# EasyEDA Pro project 2024-ZT-2.eprj

# Schematic SCH

## Sheets
1 P1: Create Date: 2024-05-02; Page Name: P1; Project Name: 2024-ZT-2; Schematic Name: SCH; Update Date: 2024-05-02; Company: 嘉立创EDA; Page Size: A4; Version: V1.0
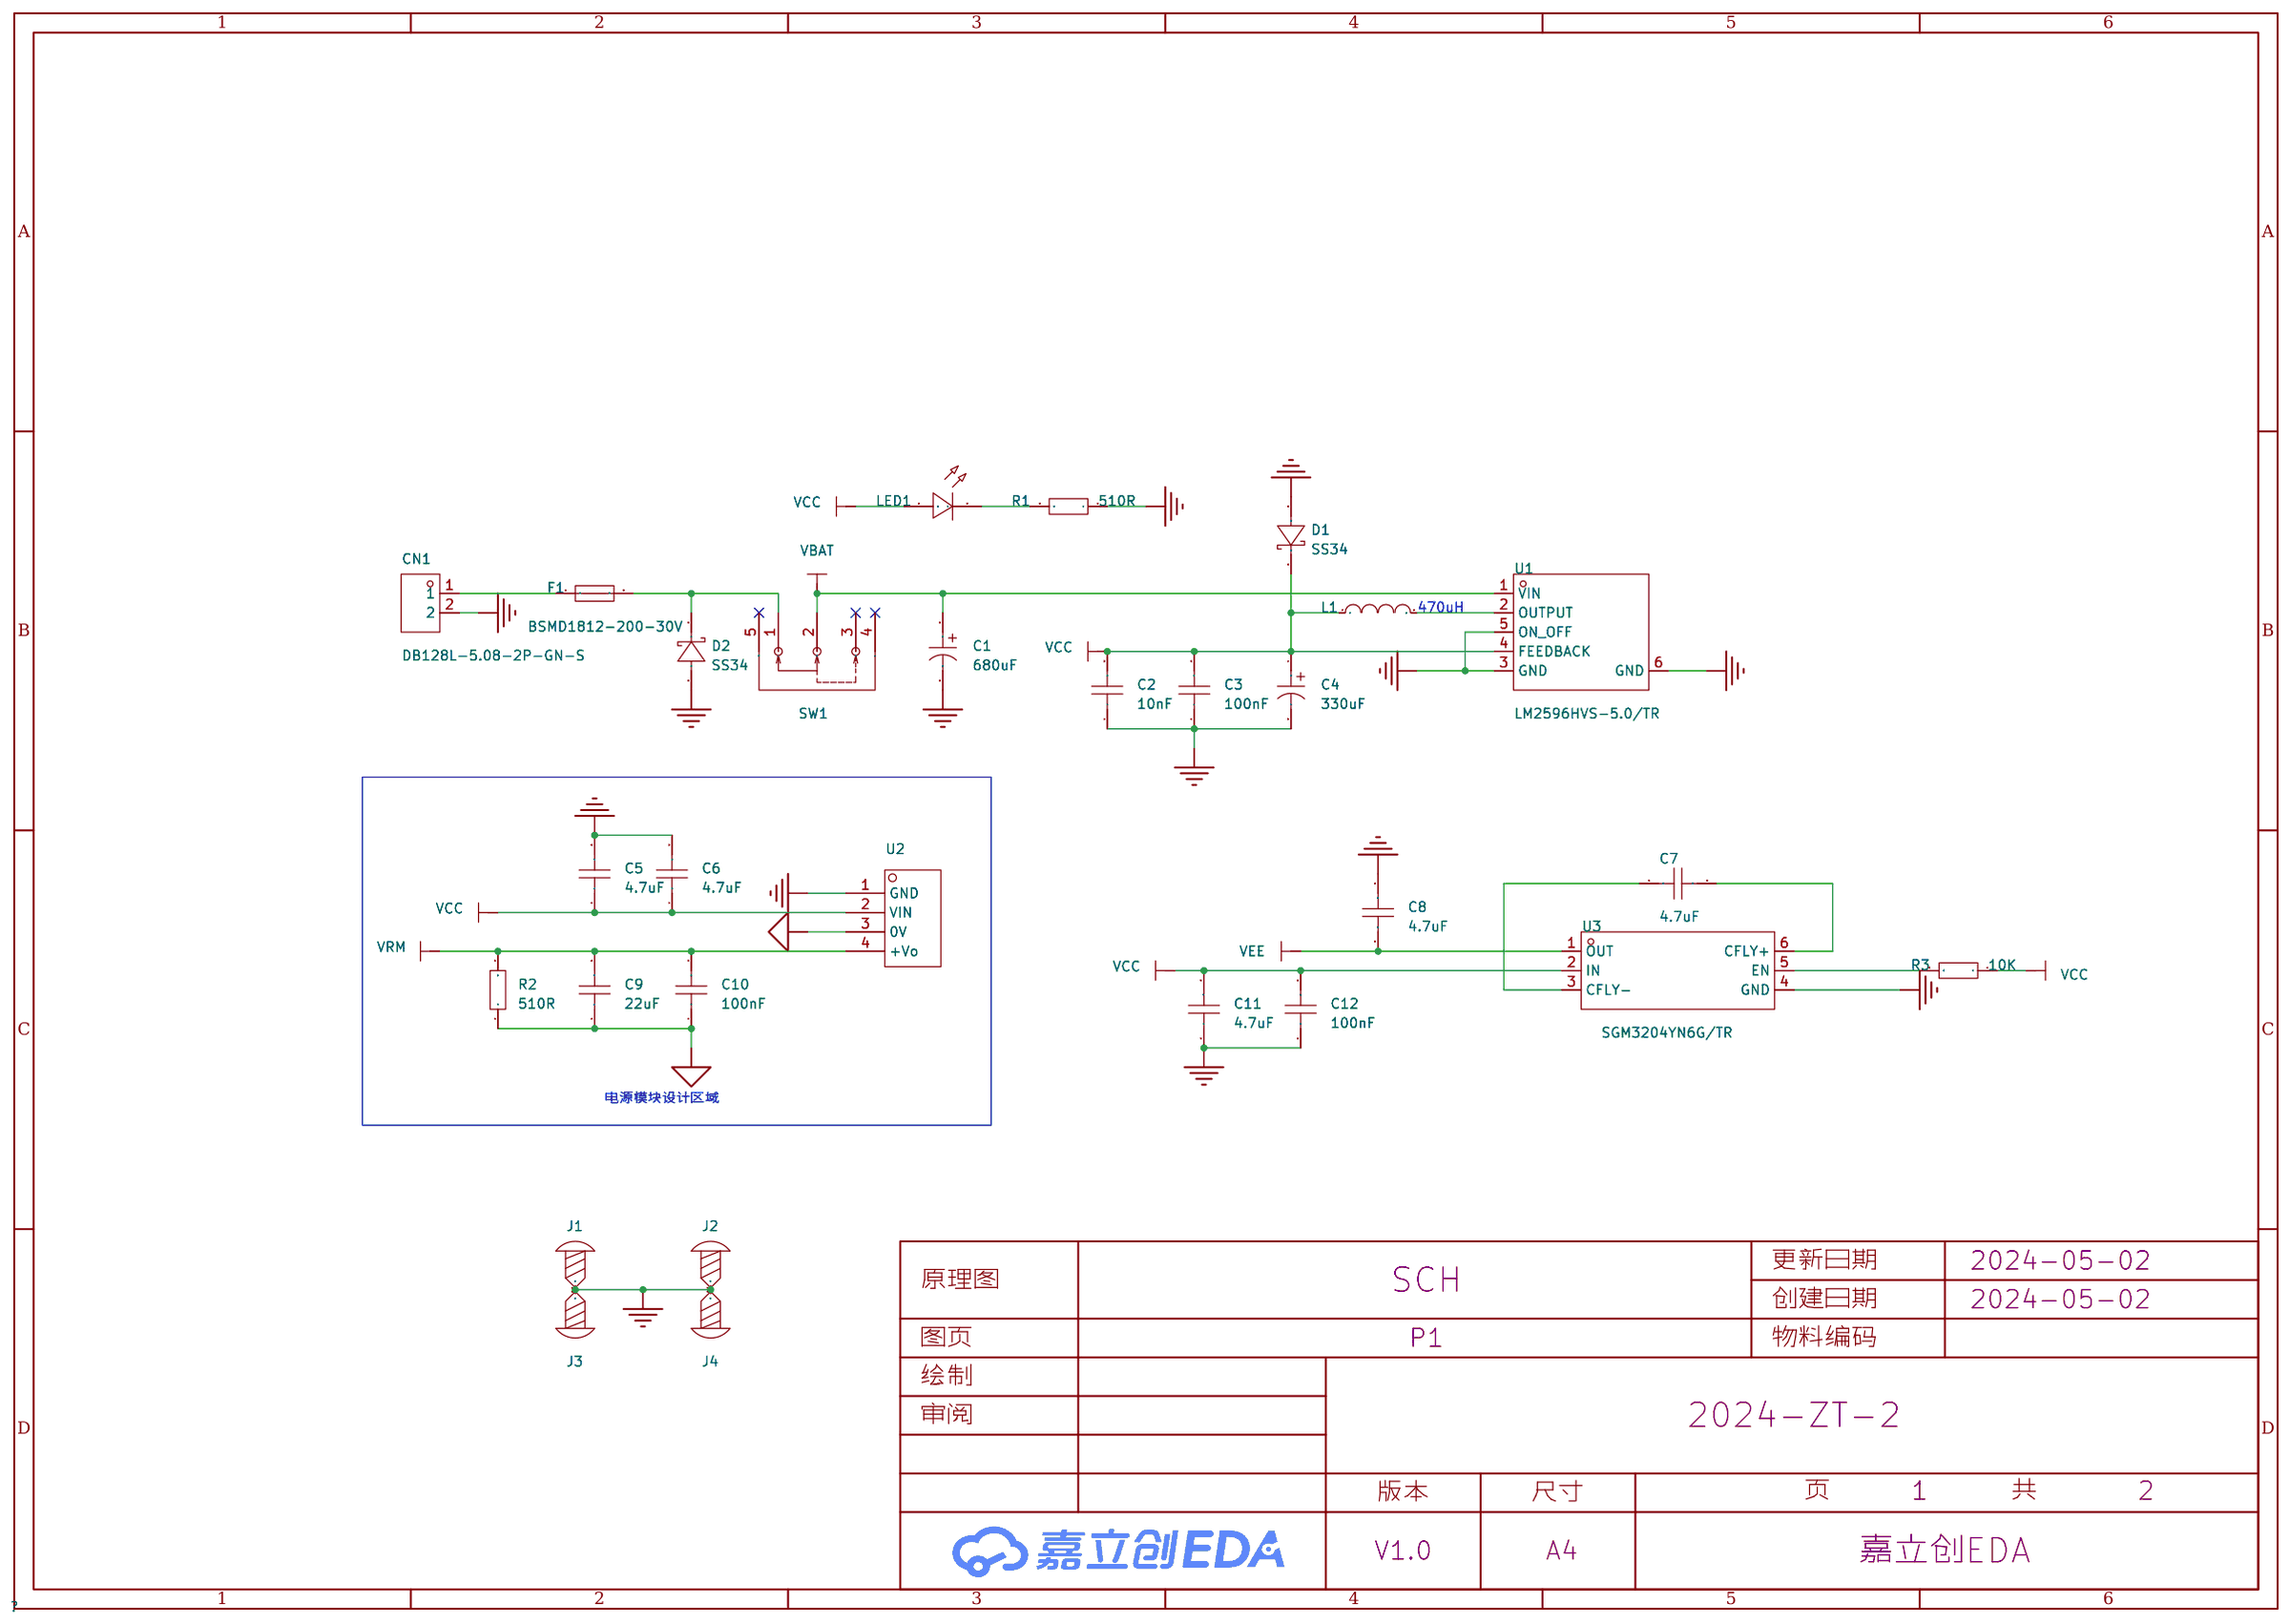
[diagram p0: P1]
2 P2: Page Name: P2; Company: EDA设计与开发
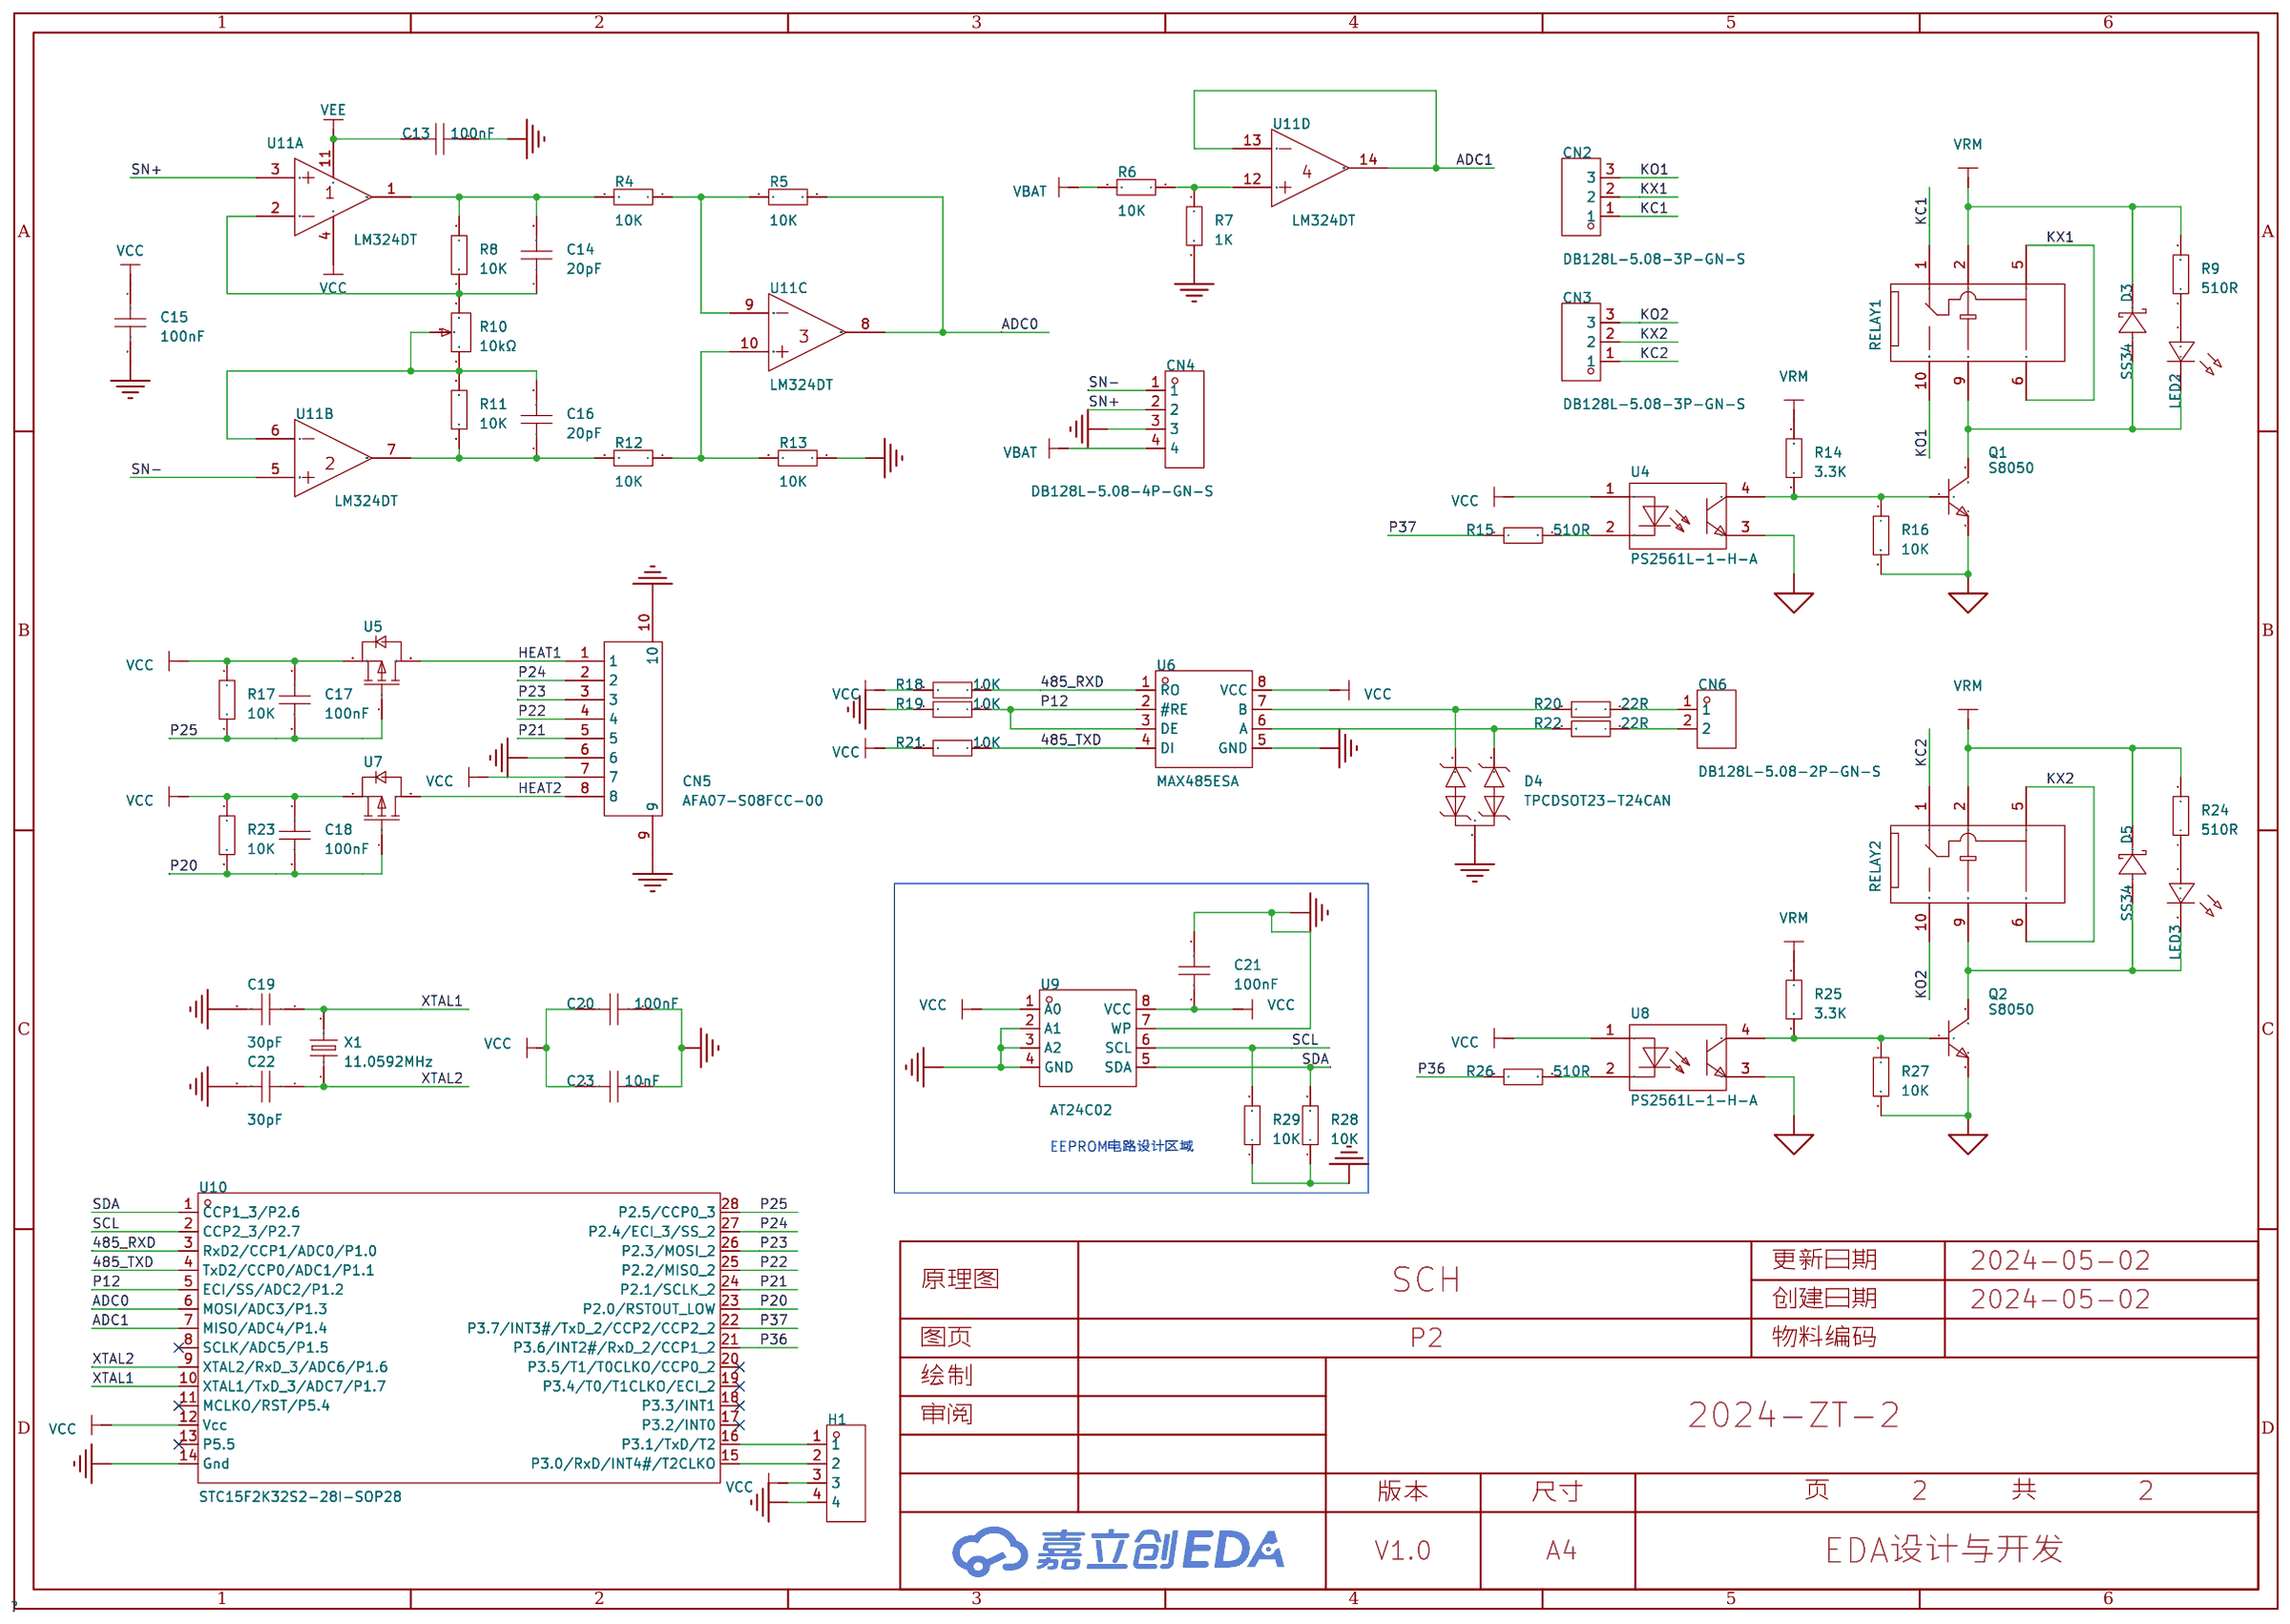
[diagram p1: P2]

## Parts
sheet P1
C1  680uF  [CAP-SMD_BD10.0-L10.3-W10.3-LS11.3-FD]
C2  10nF  [C0805]
C3  100nF  [C0805]
C4  330uF  [CAP-SMD_BD6.3-L6.6-W6.6-LS7.6-RD]
C5  4.7uF  [C1206]
C6  4.7uF  [C1206]
C7  4.7uF  [C1206]
C8  4.7uF  [C1206]
C9  22uF  [C1206]
C10  100nF  [C0805]
C11  4.7uF  [C1206]
C12  100nF  [C0805]
CN1  DB128L-5.08-2P-GN-S  [CONN-TH_2P-P5.08_DB128L-5.08-2P]
D1  SS34  [SMA_L4.3-W2.5-LS5.0-RD]
D2  SS34  [SMA_L4.3-W2.5-LS5.0-RD]
F1  BSMD1812-200-30V  [F1812]
J1  -  [M2螺丝]
J2  -  [M2螺丝]
J3  -  [M2螺丝]
J4  -  [M2螺丝]
L1  470uH  [IND-SMD_L12.0-W12.0_YPRH120X]
LED1  -  [LED_TH-3mm]
R1  510R  [R0805]
R2  510R  [R0805]
R3  10K  [R0805]
SW1  SK12D07VG4  [SW-TH_SK12D07VG4]
U1  LM2596HVS-5.0/TR  [TO-263-5_L10.2-W8.9-P1.70-LS15.2-BR]
U2  -  [TH_PCON]
U3  SGM3204YN6G/TR  [SOT-23-6_L2.9-W1.6-P0.95-LS2.8-BR]
sheet P2
C13  100nF  [C0805]
C14  20pF  [C0805]
C15  100nF  [C0805]
C16  20pF  [C0805]
C17  100nF  [C0805]
C18  100nF  [C0805]
C19  30pF  [C0805]
C20  100nF  [C0805]
C21  100nF  [C0805]
C22  30pF  [C0805]
C23  10nF  [C0805]
CN2  DB128L-5.08-3P-GN-S  [CONN-TH_DB128L-5.08-3P]
CN3  DB128L-5.08-3P-GN-S  [CONN-TH_DB128L-5.08-3P]
CN4  DB128L-5.08-4P-GN-S  [CONN-TH_4P_DB128L-5.08-4P-GN-S]
CN5  AFA07-S08FCC-00  [FPC-SMD_P1.00-8P_LCS-XJ-H2.5]
CN6  DB128L-5.08-2P-GN-S  [CONN-TH_2P-P5.08_DB128L-5.08-2P]
D3  SS34  [SMA_L4.3-W2.5-LS5.0-RD]
D4  TPCDSOT23-T24CAN  [SOT-23-3_L2.9-W1.3-P1.90-LS2.4-BR]
D5  SS34  [SMA_L4.3-W2.5-LS5.0-RD]
H1  -  [HDR-TH_4P-P2.54-V-F]
LED2  -  [LED_TH-3mm]
LED3  -  [LED_TH-3mm]
Q1  S8050  [SOT-23-3_L2.9-W1.3-P1.90-LS2.4-BR]
Q2  S8050  [SOT-23-3_L2.9-W1.3-P1.90-LS2.4-BR]
R4  10K  [R0805]
R5  10K  [R0805]
R6  10K  [R0805]
R7  1K  [R0805]
R8  10K  [R0805]
R9  510R  [R0805]
R10  10kΩ  [RES-ADJ-TH_3P-L10.0-W10.0-P2.50-BL-BS]
R11  10K  [R0805]
R12  10K  [R0805]
R13  10K  [R0805]
R14  3.3K  [R0805]
R15  510R  [R0805]
R16  10K  [R0805]
R17  10K  [R0805]
R18  10K  [R0805]
R19  10K  [R0805]
R20  22R  [R0805]
R21  10K  [R0805]
R22  22R  [R0805]
R23  10K  [R0805]
R24  510R  [R0805]
R25  3.3K  [R0805]
R26  510R  [R0805]
R27  10K  [R0805]
R28  10K  [R0805]
R29  10K  [R0805]
RELAY1  G5V-1 DC5  [RELAY-TH_G5V-1]
RELAY2  G5V-1 DC5  [RELAY-TH_G5V-1]
U4  PS2561L-1-H-A  [SOP-4_L6.5-W4.6-P2.54-LS9.6-TL]
U5  SI2301-ZE  [SOT-23-3_L2.9-W1.3-P1.90-LS2.4-BR]
U6  MAX485ESA  [SOP-8_L5.0-W4.0-P1.27-LS6.0-BL]
U7  SI2301-ZE  [SOT-23-3_L2.9-W1.3-P1.90-LS2.4-BR]
U8  PS2561L-1-H-A  [SOP-4_L6.5-W4.6-P2.54-LS9.6-TL]
U9  AT24C02  [SOP-8_L4.9-W3.9-P1.27-LS6.0-BL]
U10  STC15F2K32S2-28I-SOP28  [SOP-28_L17.9-W7.5-P1.27-LS10.3-BL]
U11  LM324DT  [SOIC-14_L8.7-W3.9-P1.27-LS6.0-BL]  (sections 1,2,3,4)
X1  11.0592MHz  [HC-49US_L11.5-W4.5-P4.88]

## Library data of the parts
C1 = 126RV0105: 容值:680uF;精度:±20%;额定电压:35V;纹波电流:380mA;; LCSC Part Name: 680uF ±20% 35V; Supplier Part: C7461236; Manufacturer: KNSCHA(科尼盛); Supplier Footprint: SMD,D10xL10.5mm; JLCPCB Part Class: Extended Part; Datasheet: https://atta.szlcsc.com/upload/public/pdf/source/20230711/6451BDCB5B323B6F7EF00B061BF0BEEC.pdf; Supplier: LCSC; Tolerance: ±20%; Rated Voltage: 35V; Ripple Current: 380mA; φD: 10mm; L: 10.5mm; Lifetime @ Temp: 2000hrs@105℃; Operating Temperature: -55℃~+105℃
C2 C3 C10 C12-C23 = CAP_0805: Supplier Footprint: 0805
C4 = 126RV0107: 容值:330uF;精度:±20%;额定电压:16V;纹波电流:170mA;; LCSC Part Name: 330uF ±20% 16V; Supplier Part: C7461238; Manufacturer: KNSCHA(科尼盛); Supplier Footprint: SMD,D6.3xL7.7mm; JLCPCB Part Class: Extended Part; Datasheet: https://atta.szlcsc.com/upload/public/pdf/source/20230711/6451BDCB5B323B6F7EF00B061BF0BEEC.pdf; Supplier: LCSC; Tolerance: ±20%; Rated Voltage: 16V; Ripple Current: 170mA; φD: 6.3mm; L: 7.7mm; Lifetime @ Temp: 2000hrs@105℃; Operating Temperature: -55℃~+105℃
C5-C9 C11 = CL31A226KOHNNNE: 容值:22uF;精度:±10%;额定电压:16V;材质(温度系数):X5R;; LCSC Part Name: 22uF ±10% 16V; Supplier Part: C90146; Manufacturer: SAMSUNG(三星); Supplier Footprint: 1206; JLCPCB Part Class: 扩展库; Datasheet: https://atta.szlcsc.com/upload/public/pdf/source/20161228/1482890861309.pdf; Supplier: LCSC; Tolerance: ±10%; Voltage Rated: 16V; Temperature Coefficient: X5R
CN1 CN6 = DB128L-5.08-2P-GN-S: 结构:1x2P;间距:5.08mm;颜色:绿色;安装方式:直插;额定电流:18A;额定电压:250V;排数:1;线规 - AWG:12~30;线规 - 平方毫米:2.5;每排PIN数:2;工作温度范围:-40℃~+105℃;; LCSC Part Name: 5.08mm 1x2P 排数:1 每排P数:2 直插; Supplier Part: C395868; Manufacturer: DORABO(地博电气); Supplier Footprint: 插件,P=5.08mm; JLCPCB Part Class: 扩展库; Datasheet: https://atta.szlcsc.com/upload/public/pdf/source/20230106/B067FE0E641A396A370D47F93C345689.pdf; Supplier: LCSC; Structure: 1x2P; Pitch: 5.08mm; Color: 绿色; Mounting Style: 直插; Current Rating (Max): 18A; Voltage Rating (Max): 250V; Number of Pins: 2P; Number of Rows: 1; Wire Gauge - AWG: 12~30; Wire Gauge - mm2: 2.5; Number of PINs Per Row: 2; Operating Temperature Range: -40℃~+105℃
D1-D3 D5 = SS34_C727060: 二极管配置:独立式;正向压降(Vf):550mV@3A;直流反向耐压(Vr):40V;平均整流电流(Io):3A;; LCSC Part Name: 电压:40V 电流:3A; Supplier Part: C727060; Manufacturer: TWGMC(台湾迪嘉); Supplier Footprint: SMA(DO-214AC); JLCPCB Part Class: 扩展库; Datasheet: https://atta.szlcsc.com/upload/public/pdf/source/20200828/C727059_6599B6CAC5F3238B9C33E46794659DBE.pdf; Supplier: LCSC; Diode Configuration: 独立式; Forward Voltage (Vf@If): 550mV@3A; Reverse Voltage (Vr): 40V; Average Rectified Current (Io): 3A; Reverse Leakage Current (Ir): 500uA@40V
F1 = BSMD1812-200-30V: 最大电压:30V;最大电流:40A;保持电流:2A;跳闸电流:4A;; LCSC Part Name: 30V 2A 1812自恢复; Supplier Part: C960026; Manufacturer: BHFUSE(佰宏); Supplier Footprint: 1812; JLCPCB Part Class: 扩展库; Datasheet: https://atta.szlcsc.com/upload/public/pdf/source/20230512/6ED7FF50F668B3AF958C55F12246A840.pdf; Supplier: LCSC; Operating Voltage (Max): 30V; Current Rating (Max): 40A; Hold Current: 2A; Trip Current: 4A; Power Dissipation: 1W; Resistance - Initial (Ri) (Min): 20mΩ; Resistance - Post Trip (R1) (Max): 100mΩ; Maximum Time to Trip: 2s; Operating Temperature: -40℃~+85℃
J1-J4 = M2螺丝: Supplier Footprint: 插件
L1 = YPRH1209-471M: 电感值:470uH;精度:±20%;额定电流:1.06A;; LCSC Part Name: 470uH ±20%; Supplier Part: C718309; Manufacturer: YJYCOIN(益嘉源); Supplier Footprint: SMD,12x12mm; JLCPCB Part Class: 扩展库; Datasheet: https://atta.szlcsc.com/upload/public/pdf/source/20200623/C339955_D39FA66995A9BB8553FDBD7D9E6E5CB5.pdf; Supplier: LCSC; Tolerance: ±20%; Rated Current: 1.06A; DC Resistance (DCR): 471mΩ
LED1 = LED_TH-R_3mm: Supplier Footprint: 插件
R1-R9 R11-R29 = Res_0805: Supplier Footprint: 0805
SW1 = SK12D07VG4: 电路结构:单刀双掷;安装方式:侧插;额定电流(DC):500mA;额定电压(DC):50V;额定电流(AC):-;额定电压(AC):-;机械寿命:5千次;; LCSC Part Name: 3脚2档位 卧插 滑动开关; Supplier Part: C393937; Manufacturer: SHOU HAN(首韩); Supplier Footprint: 插件; JLCPCB Part Class: 扩展库; Datasheet: https://atta.szlcsc.com/upload/public/pdf/source/20190521/C393937_939FE26E571CC67D2D532E953108A1B0.pdf; Supplier: LCSC; Circuit: 单刀双掷; Actuator Style: 矩形柱状; Pin Style: PC引脚; Switch Height: 8.8mm; Mounting Style: 侧插; Current Rating (DC): 500mA; Voltage Rating (DC): 50V; Mechanical Life: 5千次
U1 = LM2596HVS-5.0/TR: Supplier Part: C7421039; Manufacturer: HGSEMI(华冠); Supplier Footprint: TO-263-5; Datasheet: https://atta.szlcsc.com/upload/public/pdf/source/20230608/50F81A07F1CB4120FC66F79925E72406.pdf; Supplier: LCSC
U2 = PCON
U3 = SGM3204YN6G/TR: 功能类型:-;输入电压:1.4V~5.5V;输出电压:-5.5V~-1.4V;输出电流(最大值):200mA;; Supplier Part: C194031; Manufacturer: SGMICRO(圣邦微); Supplier Footprint: SOT-23-6; JLCPCB Part Class: 扩展库; Datasheet: https://atta.szlcsc.com/upload/public/pdf/source/20180627/C194031_755051E53122D645C36CF727711B963E.pdf; Supplier: LCSC; Input Voltage: 1.4V~5.5V; Output Voltage: -5.5V~-1.4V; Output Current (Max): 200mA; Switching Frequency: 950kHz; Number of Outputs: 1; Switch tube (built-in/external): 内置
CN2 CN3 = DB128L-5.08-3P-GN-S: 结构:1x3P;间距:5.08mm;颜色:绿色;安装方式:直插;额定电流:18A;额定电压:250V;排数:1;线规 - AWG:12~30;线规 - 平方毫米:2.5;每排PIN数:3;工作温度范围:-40℃~+105℃;; LCSC Part Name: 5.08mm 1x3P 排数:1 每排P数:3 直插; Supplier Part: C395869; Manufacturer: DORABO(地博电气); Supplier Footprint: 插件,P=5.08mm; JLCPCB Part Class: 扩展库; Datasheet: https://atta.szlcsc.com/upload/public/pdf/source/20230106/B067FE0E641A396A370D47F93C345689.pdf; Supplier: LCSC; Structure: 1x3P; Pitch: 5.08mm; Color: 绿色; Mounting Style: 直插; Current Rating (Max): 18A; Voltage Rating (Max): 250V; Number of Pins: 3P; Number of Rows: 1; Wire Gauge - AWG: 12~30; Wire Gauge - mm2: 2.5; Number of PINs Per Row: 3; Operating Temperature Range: -40℃~+105℃
CN4 = DB128L-5.08-4P-GN-S: 结构:1x4P;间距:5.08mm;颜色:绿色;安装方式:直插;额定电流:18A;额定电压:250V;排数:1;线规 - AWG:12~30;线规 - 平方毫米:2.5;每排PIN数:4;工作温度范围:-40℃~+105℃;; LCSC Part Name: 5.08mm 1x4P 排数:1 每排P数:4 直插; Supplier Part: C2827883; Manufacturer: DORABO(地博电气); Supplier Footprint: 插件,P=5.08mm; JLCPCB Part Class: 扩展库; Datasheet: https://atta.szlcsc.com/upload/public/pdf/source/20230106/B067FE0E641A396A370D47F93C345689.pdf; Supplier: LCSC; Structure: 1x4P; Pitch: 5.08mm; Color: 绿色; Mounting Style: 直插; Current Rating (Max): 18A; Voltage Rating (Max): 250V; Number of Pins: 4P; Number of Rows: 1; Wire Gauge - AWG: 12~30; Wire Gauge - mm2: 2.5; Number of PINs Per Row: 4; Operating Temperature Range: -40℃~+105℃
CN5 = AFA07-S08FCC-00: 锁定特性:抽屉式;触点类型:下接;触点数量:8P;间距:1mm;安装类型:卧贴;; LCSC Part Name: 间距:1mm P数:8P 抽屉式 下接; Supplier Part: C262342; Manufacturer: JS(钜硕电子); Supplier Footprint: SMD,P=1mm,卧贴; JLCPCB Part Class: 扩展库; Datasheet: https://atta.szlcsc.com/upload/public/pdf/source/20191217/C262716_30B15E9A77BFCA4A54741C92DB3BE8CC.pdf; Supplier: LCSC; Locking Feature: 抽屉式; Contact Type: 下接; Number of Contacts: 8P; Pitch: 1mm; Mounting Type: 卧贴; FFC, FCB Thickness: 0.3mm; Height Above Board: 2.5mm
D4 = TPCDSOT23-T24CAN: Supplier Part: C970033; Manufacturer: TECH PUBLIC(台舟); Supplier Footprint: SOT-23; JLCPCB Part Class: 扩展库; Datasheet: https://atta.szlcsc.com/upload/public/pdf/source/20230522/C1F3B36253468277A14BE124FFAB154C.pdf; Supplier: LCSC
H1 = HDR-F_2.54_1x4P: Supplier Part: C2718488; Supplier Footprint: 插件
LED2 LED3 = LED_TH-G_3mm: Supplier Footprint: 插件
Q1 Q2 = S8050_C2891804: 晶体管类型:NPN;集电极电流(Ic):500mA;集射极击穿电压(Vceo):25V;功率(Pd):300mW;; LCSC Part Name: NPN 电流:500mA 耐压:25V; Supplier Part: C2891804; Manufacturer: YONGYUTAI(永裕泰); Supplier Footprint: SOT-23; JLCPCB Part Class: Extended Part; Datasheet: https://atta.szlcsc.com/upload/public/pdf/source/20210901/5347316A10609C628D4D69AE01446E5B.pdf; Supplier: LCSC; Transistor Type: NPN; Collector Current (Ic): 500mA; Collector-Emitter Breakdown Voltage (Vceo): 25V; Power Dissipation (Pd): 300mW; Collector Cut-Off Current (Icbo): 1uA; Collector-Emitter Saturation Voltage (VCE(sat)@Ic,Ib): 500mV@500mA,50mA
R10 = 3296W-1-203LF: 阻值:20kΩ;精度:±10%;功率:500mW;温度系数:±100ppm/℃;; LCSC Part Name: 20kΩ ±10%; Supplier Part: C34845; Manufacturer: BOURNS; Supplier Footprint: 插件; JLCPCB Part Class: 扩展库; Datasheet: https://atta.szlcsc.com/upload/public/pdf/source/20151026/1457707506403.pdf; Supplier: LCSC; Tolerance: ±10%; Power(Watts): 500mW; Temperature Coefficient: ±100ppm/℃; Turns: 25
RELAY1 RELAY2 = G5V-1 DC5: 线圈电压:5V;触点形式:一组转换:1C(单刀双掷-转换);触点容量(电阻负载):-;最大切换电压:125V@AC；60V@DC;最大切换电流:1A;; LCSC Part Name: 继电器G5V-1-5VDC; Supplier Part: C28695; Manufacturer: OMRON(欧姆龙); Supplier Footprint: DIP,7.5x12.5mm; JLCPCB Part Class: 扩展库; Supplier: LCSC; Coil Voltage: 5V; Contact Form: 一组转换:1C(单刀双掷-转换); Maximum Switching Voltage: 125V@AC；60V@DC; Contact Material: 银+镀金; Maximum Switching Current: 1A; Operate Time: 5ms; Release Time: 5ms; Operating Temperature: -40℃~+70℃
U4 U8 = PS2561L-1-H-A: Supplier Part: C145672; Manufacturer: California Eastern Laboratories; Supplier Footprint: SOP-4-2.54mm; JLCPCB Part Class: 扩展库; Datasheet: https://atta.szlcsc.com/upload/public/pdf/source/20180125/C145673_15168615431091301608.pdf; Supplier: LCSC
U5 U7 = SI2301-ZE: 类型:P沟道;漏源电压(Vdss):20V;连续漏极电流(Id):2.3A;功率(Pd):700mW;导通电阻(RDS(on)@Vgs,Id):126mΩ@4.5V;阈值电压(Vgs(th)@Id):1V@250uA;; LCSC Part Name: P沟道 耐压:20V 电流:2.3A; Supplier Part: C5261052; Manufacturer: HXY MOSFET(华轩阳电子); Supplier Footprint: SOT-23; JLCPCB Part Class: 扩展库; Datasheet: https://atta.szlcsc.com/upload/public/pdf/source/20230515/2FF2907841563ED329594D3237822724.pdf; Supplier: LCSC; Type: P沟道; Drain Source Voltage (Vdss): 20V; Continuous Drain Current (Id): 2.3A; Power Dissipation (Pd): 700mW; Drain Source On Resistance (RDS(on)@Vgs,Id): 126mΩ@4.5V; Gate Threshold Voltage (Vgs(th)@Id): 1V@250uA; Input Capacitance (Ciss@Vds): 285pF
U6 = MAX485ESA_C668206: Supplier Part: C668206; Manufacturer: UMW(友台半导体); Supplier Footprint: SOP-8; JLCPCB Part Class: 扩展库; Datasheet: https://atta.szlcsc.com/upload/public/pdf/source/20231109/489730AE87B90C4B6B8CE65C07B1054C.pdf; Supplier: LCSC
U9 = AT24C02_C7470930: 接口类型:I2C;存储容量:2Kbit;时钟频率(fc):400kHz~1MHz;; LCSC Part Name: AT24C02  2Kbit 12C; Supplier Part: C7470930; Manufacturer: HXY MOSFET(华轩阳电子); Supplier Footprint: SOP-8; JLCPCB Part Class: 扩展库; Datasheet: https://atta.szlcsc.com/upload/public/pdf/source/20230913/748AF0FF0068DF582FAC58AD968E8A28.pdf; Supplier: LCSC; Interface Type: I2C; Memory Size: 2Kbit; Clock Frequency (fc): 400kHz~1MHz; Supply Voltage: 1.8V~5.5V; Data Retention - TDR (Year): 100年
U10 = STC15F2K32S2-28I-SOP28: LCSC Part Name: STC15F2K32S2-28I- SOP28; Supplier Part: C194605; Manufacturer: STC(宏晶); Supplier Footprint: SOP-28-300mil; JLCPCB Part Class: 扩展库; Datasheet: https://atta.szlcsc.com/upload/public/pdf/source/20180730/C194606_29BB2C4DE21484D9E9511E7CB40FB26F.pdf; Supplier: LCSC
U11 = LM324DT: 放大器数:四路;增益带宽积(GBP):1.3MHz;输入偏置电流(Ib):20nA;压摆率(SR):0.4V/us;带宽(-3db):-;; Supplier Part: C71035; Manufacturer: ST(意法半导体); Supplier Footprint: SOIC-14; JLCPCB Part Class: 基础库; Datasheet: https://atta.szlcsc.com/upload/public/pdf/source/20160408/1460100649718.pdf; Supplier: LCSC; Number of Circuits: 四路; Gain Bandwidth Product(GBP): 1.3MHz; Current - Input Bias(Ib): 20nA; Slew Rate(SR): 0.4V/us; Output Current: 40mA; Supply Current: 1.5mA; Operating Temperature: 0℃~+70℃
X1 = TAXD11.0592M2GLFBET2T: 晶振类型:直插晶振;频率:11.0592MHz;常温频差:±30ppm;外接负载电容:20pF;频率稳定度(全温):±30ppm;; LCSC Part Name: 11.0592MHz ±30ppm 20pF; Supplier Part: C127675; Manufacturer: YJX(雅晶鑫); Supplier Footprint: HC-49S; JLCPCB Part Class: 扩展库; Datasheet: https://atta.szlcsc.com/upload/public/pdf/source/20170914/C127676_1505359415156967690.pdf; Supplier: LCSC; Crystal Type: 直插晶振; Normal temperature Frequency Tolerance: ±30ppm; External load capacitor: 20pF; Frequency Stability(Full temperature range): ±30ppm; Equivalent Series Resistance (ESR): 50Ω; Operating Temperature: -20℃~+70℃

## Nets
GND: C1.2 C2.1 C3.1 C4.2 C5.2 C6.2 C8.1 C11.1 C12.1 C13.1 C15.2 C19.2 C20.1 C21.2 C22.2 C23.1 CN1.2 CN4.3 CN5.6 CN5.9 CN5.10 D1.2(A) D2.2(A) D4.3 H1.4 J1.1 J2.1 J3.1 J4.1 R1.1 R7.2 R13.1 R19.2 R28.1 R29.1 U1.3(GND) U1.5(ON_OFF) U1.6(GND) U2.1(GND) U3.4(GND) U6.5(GND) U9.2(A1) U9.3(A2) U9.4(GND) U9.7(WP) U10.14(Gnd)
VBAT: C1.1 CN4.4 R6.2 SW1.2 U1.1(VIN)
VCC: C2.2 C3.2 C4.1 C5.1 C6.1 C11.2 C12.2 C15.1 C17.1 C18.1 C20.2 C21.1 C23.2 CN5.7 D1.1(C) H1.3 L1.1 LED1.1(C) R3.1 R17.1 R18.2 R21.2 R23.1 U1.4(FEEDBACK) U2.2(VIN) U3.2(IN) U4.1 U5.2(S) U6.8(VCC) U7.2(S) U8.1 U9.1(A0) U9.8(VCC) U10.12(Vcc) U11.4(VCC+)
VEE: C8.2 C13.2 U3.1(OUT) U11.11(VCC-)
0: C9.1 C10.1 Q1.2(E) Q2.2(E) R2.1 R16.2 R27.2 U2.3(0V) U4.3 U8.3
485_RXD: R18.1 U6.1(RO) U10.3(RxD2/CCP1/ADC0/P1.0)
485_TXD: R21.1 U6.4(DI) U10.4(TxD2/CCP0/ADC1/P1.1)
ADC0: R5.1 U10.6(MOSI/ADC3/P1.3) U11.8(OUT3)
ADC1: U10.7(MISO/ADC4/P1.4) U11.13(IN4-) U11.14(OUT4)
HEAT1: CN5.1 U5.3(D)
HEAT2: CN5.8 U7.3(D)
KC1: CN2.1 RELAY1.1
KC2: CN3.1 RELAY2.1
KO1: CN2.3 RELAY1.10
KO2: CN3.3 RELAY2.10
KX1: CN2.2 RELAY1.5 RELAY1.6
KX2: CN3.2 RELAY2.5 RELAY2.6
P12: R19.1 U6.2(#RE) U6.3(DE) U10.5(ECI/SS/ADC2/P1.2)
P20: C18.2 R23.2 U7.1(G) U10.23(P2.0/RSTOUT_LOW)
P21: CN5.5 U10.24(P2.1/SCLK_2)
P22: CN5.4 U10.25(P2.2/MISO_2)
P23: CN5.3 U10.26(P2.3/MOSI_2)
P24: CN5.2 U10.27(P2.4/ECI_3/SS_2)
P25: C17.2 R17.2 U5.1(G) U10.28(P2.5/CCP0_3)
P36: R26.1 U10.21(P3.6/INT2#/RxD_2/CCP1_2)
P37: R15.1 U10.22(P3.7/INT3#/TxD_2/CCP2/CCP2_2)
SCL: R29.2 U9.6(SCL) U10.2(CCP2_3/P2.7)
SDA: R28.2 U9.5(SDA) U10.1(CCP1_3/P2.6)
SN+: CN4.2 U11.3(IN1+)
SN-: CN4.1 U11.5(IN2+)
VRM: C9.2 C10.2 D3.1(C) D5.1(C) R2.2 R9.2 R14.1 R24.2 R25.1 RELAY1.2 RELAY2.2 U2.4(+Vo)
XTAL1: C19.1 U10.10(XTAL1/TxD_3/ADC7/P1.7) X1.2
XTAL2: C22.1 U10.9(XTAL2/RxD_3/ADC6/P1.6) X1.1
$1N5406: CN1.1 F1.1
$1N6010: L1.2 U1.2(OUTPUT)
$1N7874: R3.2 U3.5(EN)
$1N8048: C7.2 U3.6(CFLY+)
$1N8053: C7.1 U3.3(CFLY-)
$1N8284: LED1.2(A) R1.2
$1N8627: D2.1(C) F1.2 SW1.1
$2N2031: C16.1 R11.1 R12.2 U11.7(OUT2)
$2N2092: R12.1 R13.2 U11.10(IN3+)
$2N2099: R4.1 R5.2 U11.9(IN3-)
$2N2266: C14.1 R8.1 R10.1 U11.2(IN1-)
$2N2273: C14.2 R4.2 R8.2 U11.1(OUT1)
$2N2314: C16.2 R10.2 R10.3 R11.2 U11.6(IN2-)
$2N3023: CN6.1 R20.1
$2N3053: CN6.2 R22.1
$2N3244: D4.1 R22.2 U6.6(A)
$2N3251: D4.2 R20.2 U6.7(B)
$2N3377: R15.2 U4.2
$2N3466: Q1.1(B) R14.2 R16.1 U4.4
$2N4164: R26.2 U8.2
$2N4168: Q2.1(B) R25.2 R27.1 U8.4
$2N4738: LED2.1(C) R9.1
$2N4742: D3.2(A) LED2.2(A) Q1.3(C) RELAY1.9
$2N4893: LED3.1(C) R24.1
$2N4914: D5.2(A) LED3.2(A) Q2.3(C) RELAY2.9
$2N5025: R6.1 R7.1 U11.12(IN4+)
$2N7138: H1.1 U10.16(P3.1/TxD/T2)
$2N7141: H1.2 U10.15(P3.0/RxD/INT4#/T2CLKO)

Not connected (* = marked no-connect by the designer): SW1 3* 4* 5*; U10 8(SCLK/ADC5/P1.5)* 11(MCLKO/RST/P5.4)* 13(P5.5)* 17(P3.2/INT0)* 18(P3.3/INT1)* 19(P3.4/T0/T1CLKO/ECI_2)* 20(P3.5/T1/T0CLKO/CCP0_2)*

## Notes on the sheets
sheet 1
- 电源模块设计区域
sheet 2
- EEPROM电路设计区域

# Board PCB
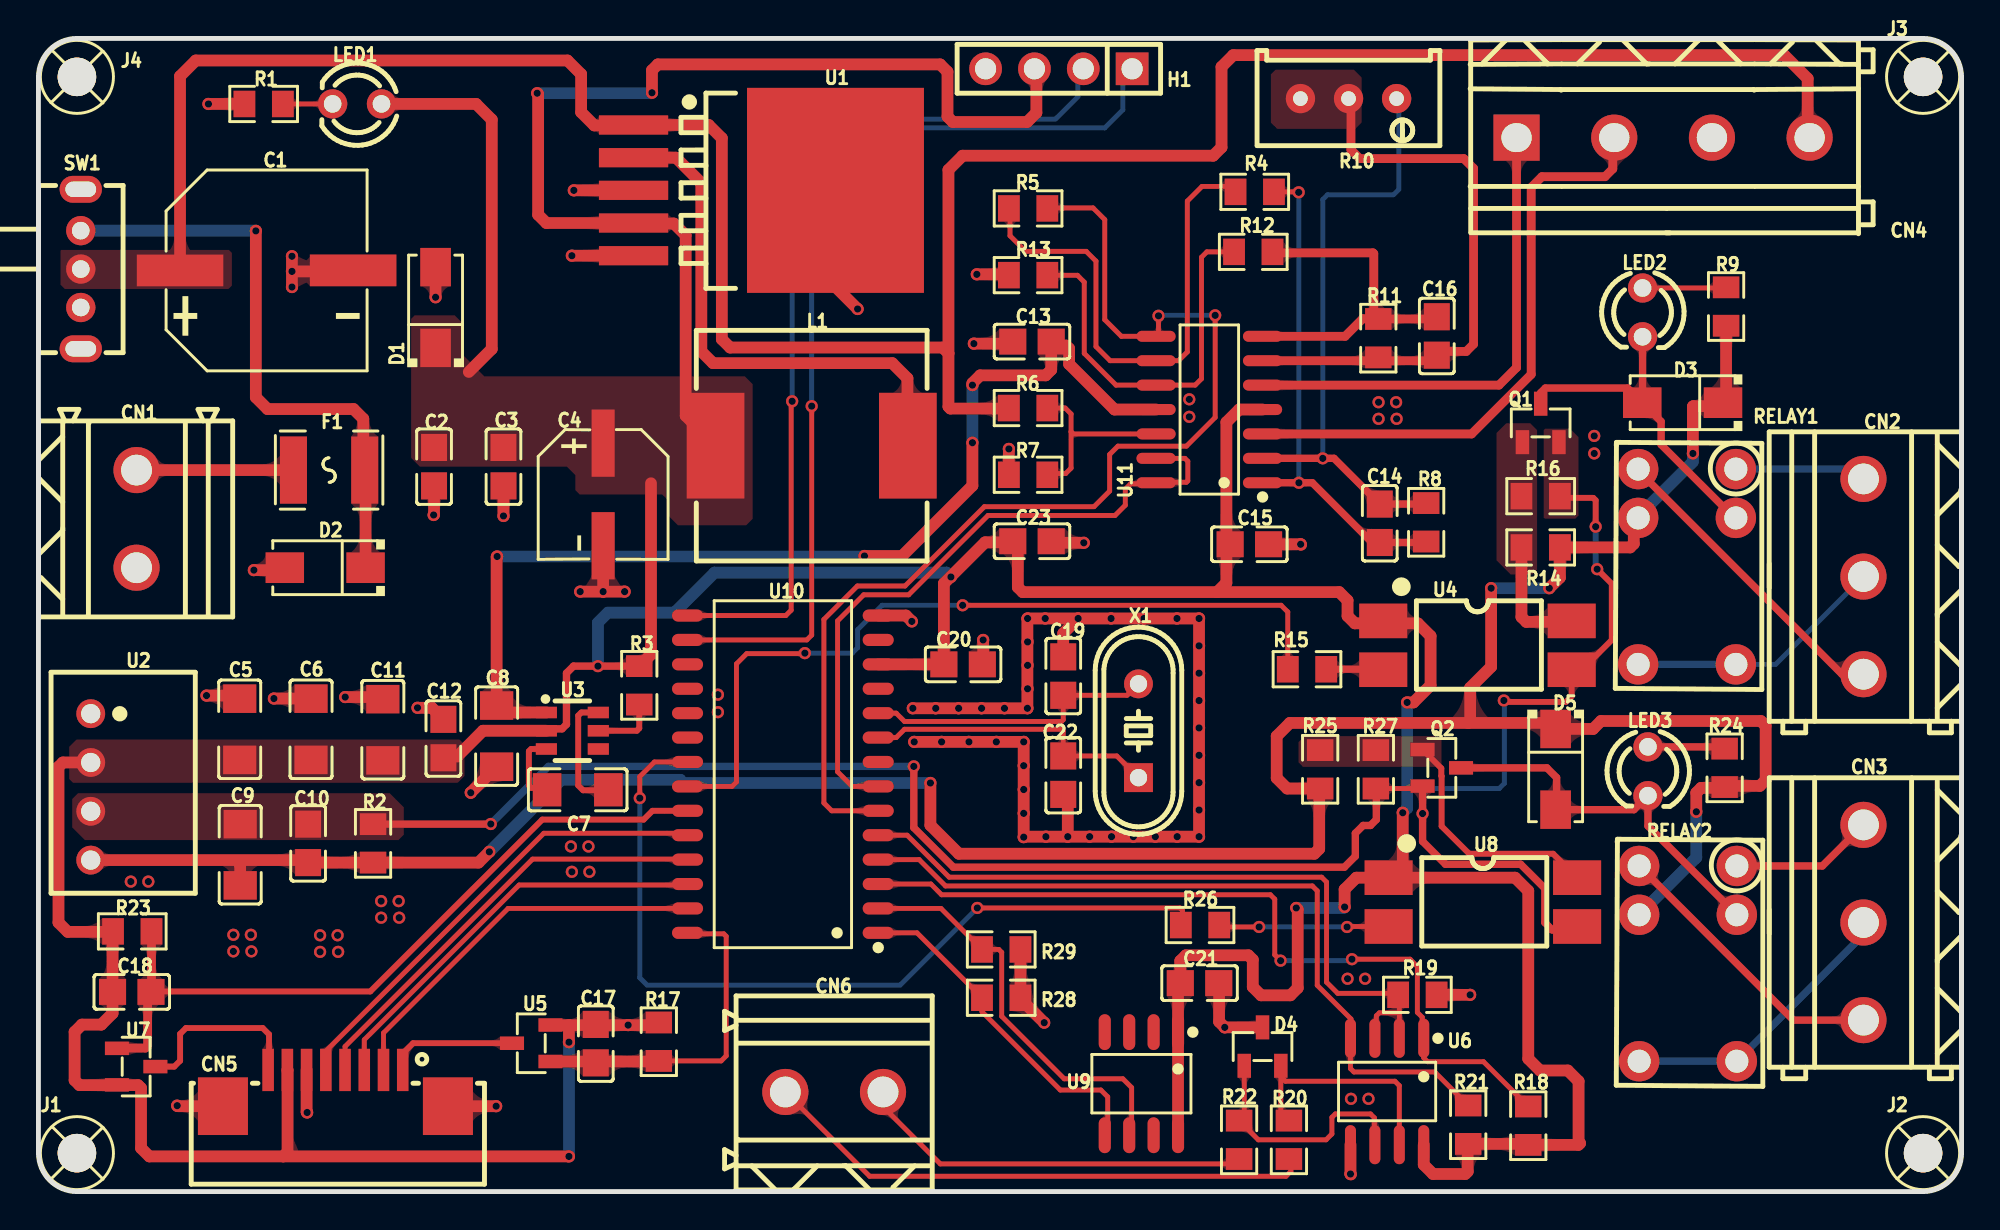
[diagram p2: board, top side]
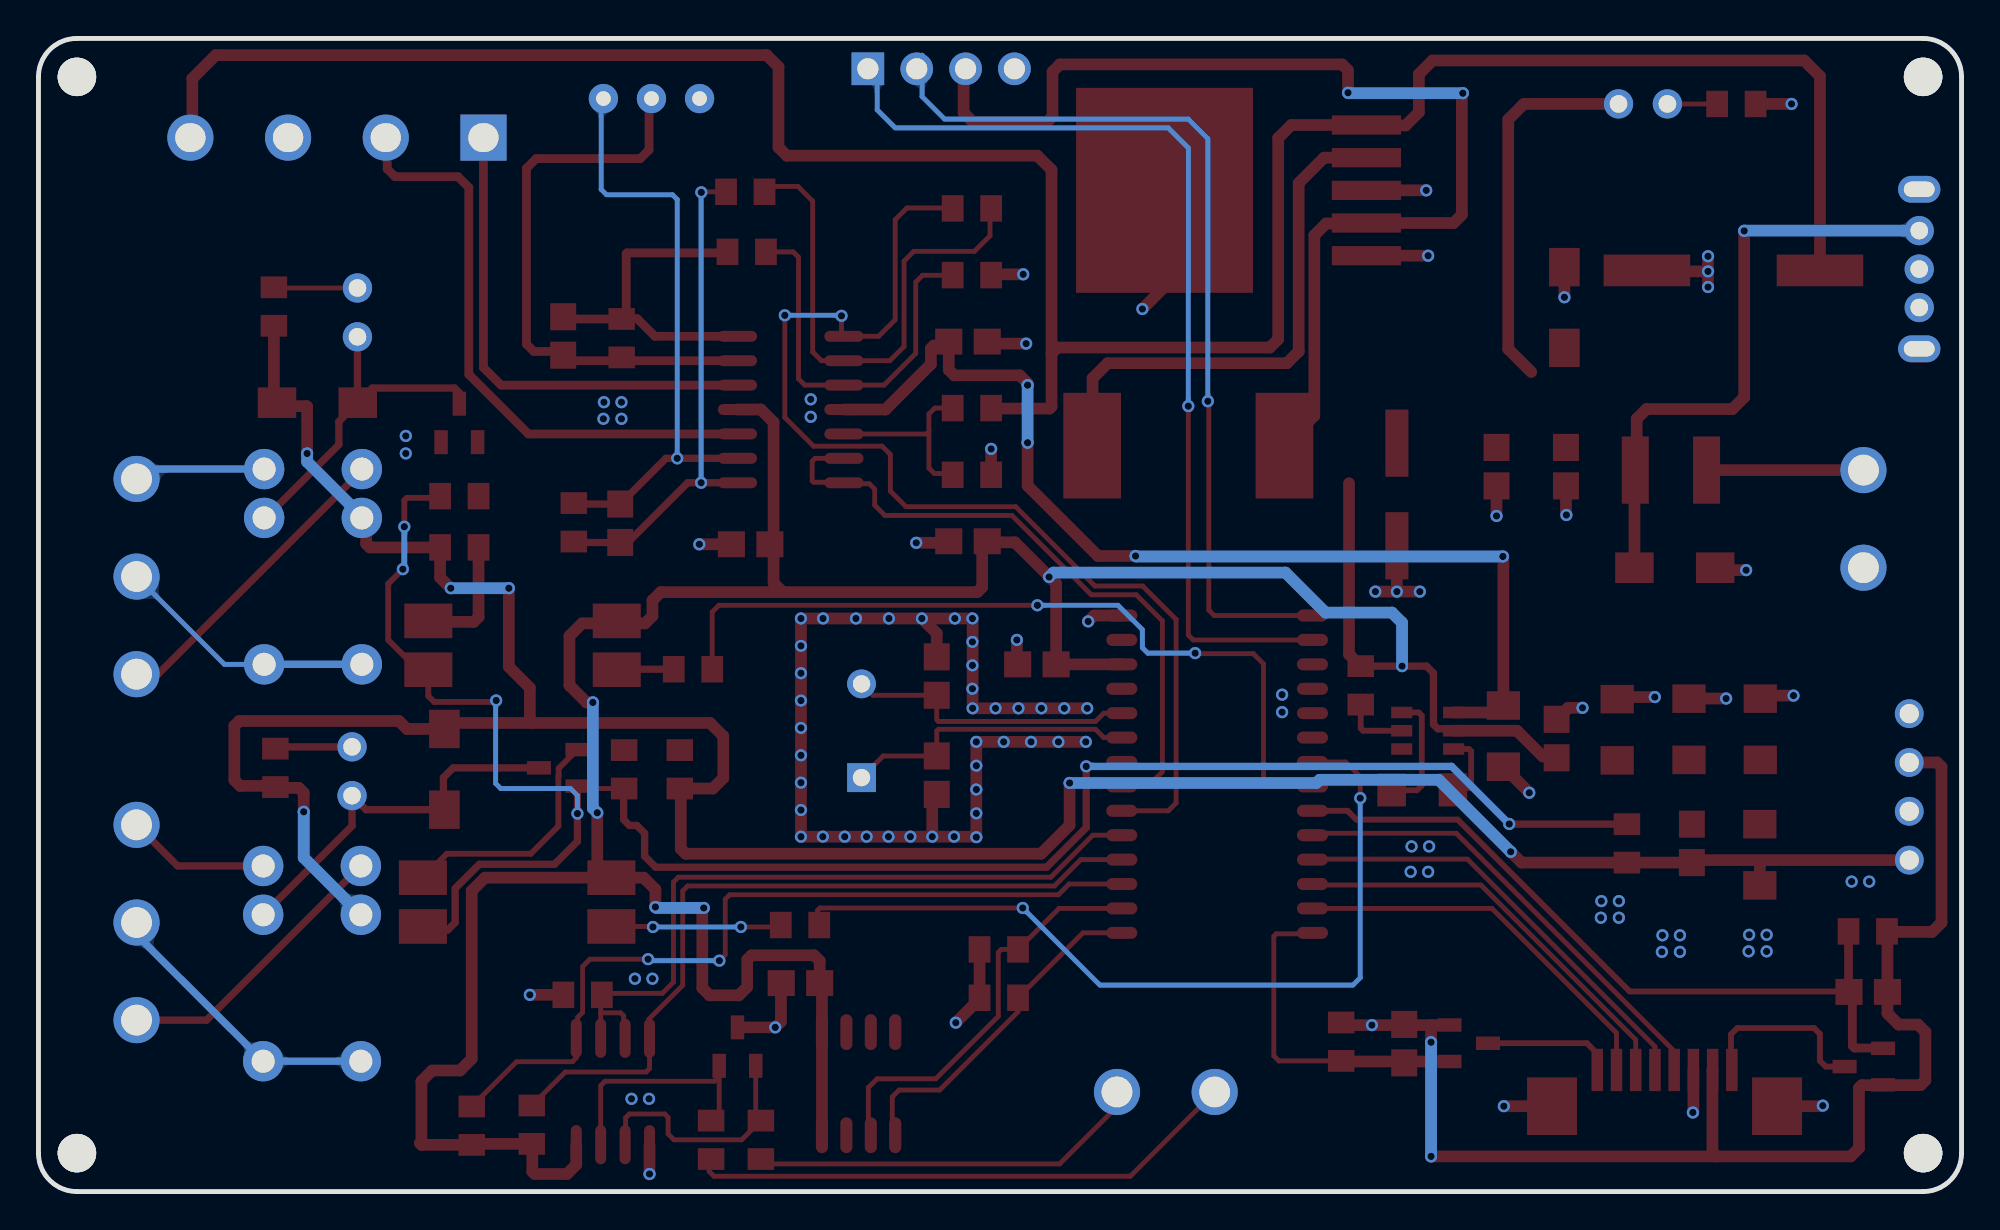
[diagram p3: board, bottom side, seen from below]

Outline 100 x 60 mm; copper layers: Top Layer, Bottom Layer. Coordinates in mm from the lower left corner of the outline.
Outline path: 0,58 0,2 arc(0.59,0.59) 2,0 98,0 arc(99.41,0.59) 100,2 100,58 arc(99.41,59.41) 98,60 2,60 arc(0.59,59.41) 0,58
Stack: Top Layer 0.035mm / Dielectric1 1.51mm FR4 er 4.5 / Bottom Layer 0.035mm

## Design rules (mm)
net XTAL2: DP1
net XTAL1: DP1
template: 自定义配置
spacing copperThickness1oz (default): track to track 0.203, other pairs 0.152 to 0.203
spacing copperThickness2oz: track to track 0.203, other pairs 0.152 to 0.3
track width copperThickness1oz (default): min 0.254, default 0.254, max 2.54
track width copperThickness2oz: min 0.203, default 0.254, max 2.54
track width PWR: min 0.254, default 0.61, max 2.54
differential pair differentialPair (default): width min 0.127, default 0.254, max 2.54; gap min 0.152, default 0.152
via viaSize (default): diameter min 0.635, default 0.635, max 10; hole min 0.381, default 0.381, max 6.299
net GND uses PWR
net VBAT uses PWR
net VCC uses PWR
net VRM uses PWR
net VEE uses PWR

## Placement (name value [footprint] x y rotation side)
C1  680uF  [CAP-SMD_BD10.0-L10.3-W10.3-LS11.3-FD]  11.86 47.93 0 top
C2  10nF  [C0805]  20.57 37.72 90 top
C3  100nF  [C0805]  24.18 37.72 90 top
C4  330uF  [CAP-SMD_BD6.3-L6.6-W6.6-LS7.6-RD]  29.36 36.27 270 top
C5  4.7uF  [C1206]  10.47 24.05 90 top
C6  4.7uF  [C1206]  14.17 24.05 90 top
C7  4.7uF  [C1206]  28.04 20.9 0 top
C8  4.7uF  [C1206]  23.83 23.7 90 top
C9  22uF  [C1206]  10.49 17.52 270 top
C10  100nF  [C0805]  14.02 18.12 270 top
C11  4.7uF  [C1206]  17.91 24.03 270 top
C12  100nF  [C0805]  21.06 23.57 270 top
C13  100nF  [C0805]  51.66 44.23 0 top
C14  20pF  [C0805]  69.75 34.77 270 top
C15  100nF  [C0805]  62.97 33.68 0 top
C16  20pF  [C0805]  72.71 44.52 270 top
C17  100nF  [C0805]  28.98 7.7 270 top
C18  100nF  [C0805]  4.85 10.39 0 top
C19  30pF  [C0805]  53.29 26.82 90 top
C20  100nF  [C0805]  48.08 27.43 180 top
C21  100nF  [C0805]  60.38 10.85 0 top
C22  30pF  [C0805]  53.29 21.67 270 top
C23  10nF  [C0805]  51.66 33.84 180 top
CN1  DB128L-5.08-2P-GN-S  [CONN-TH_2P-P5.08_DB128L-5.08-2P]  5.1 35 270 top
CN2  DB128L-5.08-3P-GN-S  [CONN-TH_DB128L-5.08-3P]  94.9 32 90 top
CN3  DB128L-5.08-3P-GN-S  [CONN-TH_DB128L-5.08-3P]  94.9 14 90 top
CN4  DB128L-5.08-4P-GN-S  [CONN-TH_4P_DB128L-5.08-4P-GN-S]  84.48 54.84 180 top
CN5  AFA07-S08FCC-00  [FPC-SMD_P1.00-8P_LCS-XJ-H2.5]  15.44 5.38 180 top
CN6  DB128L-5.08-2P-GN-S  [CONN-TH_2P-P5.08_DB128L-5.08-2P]  41.38 5.18 0 top
D1  SS34  [SMA_L4.3-W2.5-LS5.0-RD]  20.65 46 90 top
D2  SS34  [SMA_L4.3-W2.5-LS5.0-RD]  14.91 32.46 180 top
D3  SS34  [SMA_L4.3-W2.5-LS5.0-RD]  85.5 41.05 180 top
D4  TPCDSOT23-T24CAN  [SOT-23-3_L2.9-W1.3-P1.90-LS2.4-BR]  63.65 7.54 270 top
D5  SS34  [SMA_L4.3-W2.5-LS5.0-RD]  78.89 21.97 270 top
F1  BSMD1812-200-30V  [F1812]  15.11 37.54 0 top
H1  -  [HDR-TH_4P-P2.54-V-F]  53.06 58.42 180 top
J1  -  [M2螺丝]  2 2 0 top
J2  -  [M2螺丝]  98 2 0 top
J3  -  [M2螺丝]  98 58 0 top
J4  -  [M2螺丝]  2 58 0 top
L1  470uH  [IND-SMD_L12.0-W12.0_YPRH120X]  40.21 38.81 0 top
LED1  -  [LED_TH-3mm]  16.57 56.59 180 top
LED2  -  [LED_TH-3mm]  83.41 45.75 270 top
LED3  -  [LED_TH-3mm]  83.69 21.87 270 top
Q1  S8050  [SOT-23-3_L2.9-W1.3-P1.90-LS2.4-BR]  78.12 39.99 270 top
Q2  S8050  [SOT-23-3_L2.9-W1.3-P1.90-LS2.4-BR]  72.97 22.05 180 top
R1  510R  [R0805]  11.71 56.59 0 top
R2  510R  [R0805]  17.4 18.12 270 top
R3  10K  [R0805]  31.24 26.34 270 top
R4  10K  [R0805]  63.25 52.02 0 top
R5  10K  [R0805]  51.46 51.16 180 top
R6  10K  [R0805]  51.46 40.77 180 top
R7  1K  [R0805]  51.46 37.3 180 top
R8  10K  [R0805]  72.16 34.82 270 top
R9  510R  [R0805]  87.76 46.05 270 top
R10  10kΩ  [RES-ADJ-TH_3P-L10.0-W10.0-P2.50-BL-BS]  68.12 56.87 270 top
R11  10K  [R0805]  69.67 44.4 270 top
R12  10K  [R0805]  63.17 48.89 0 top
R13  10K  [R0805]  51.46 47.68 0 top
R14  3.3K  [R0805]  78.12 33.52 180 top
R15  510R  [R0805]  65.96 27.18 0 top
R16  10K  [R0805]  78.12 36.18 0 top
R17  10K  [R0805]  32.26 7.8 270 top
R18  10K  [R0805]  77.47 3.43 270 top
R19  10K  [R0805]  71.7 10.24 0 top
R20  22R  [R0805]  65.02 2.69 90 top
R21  10K  [R0805]  74.35 3.48 270 top
R22  22R  [R0805]  62.43 2.69 90 top
R23  10K  [R0805]  4.88 13.54 0 top
R24  510R  [R0805]  87.68 22.05 270 top
R25  3.3K  [R0805]  66.65 21.97 90 top
R26  510R  [R0805]  60.4 13.87 0 top
R27  10K  [R0805]  69.54 21.97 270 top
R28  10K  [R0805]  50.06 10.08 180 top
R29  10K  [R0805]  50.06 12.6 180 top
RELAY1  G5V-1 DC5  [RELAY-TH_G5V-1]  85.72 32.51 270 top
RELAY2  G5V-1 DC5  [RELAY-TH_G5V-1]  85.78 11.86 270 top
SW1  SK12D07VG4  [SW-TH_SK12D07VG4]  2.2 48 270 top
U1  LM2596HVS-5.0/TR  [TO-263-5_L10.2-W8.9-P1.70-LS15.2-BR]  36.19 52.1 180 top
U2  -  [TH_PCON]  2.72 24.87 270 top
U3  SGM3204YN6G/TR  [SOT-23-6_L2.9-W1.6-P0.95-LS2.8-BR]  27.76 23.98 180 top
U4  PS2561L-1-H-A  [SOP-4_L6.5-W4.6-P2.54-LS9.6-TL]  74.83 28.42 0 top
U5  SI2301-ZE  [SOT-23-3_L2.9-W1.3-P1.90-LS2.4-BR]  25.63 7.72 0 top
U6  MAX485ESA  [SOP-8_L5.0-W4.0-P1.27-LS6.0-BL]  70.13 5.21 180 top
U7  SI2301-ZE  [SOT-23-3_L2.9-W1.3-P1.90-LS2.4-BR]  5.08 6.5 180 top
U8  PS2561L-1-H-A  [SOP-4_L6.5-W4.6-P2.54-LS9.6-TL]  75.11 15.06 0 top
U9  AT24C02  [SOP-8_L4.9-W3.9-P1.27-LS6.0-BL]  57.35 5.61 180 top
U10  STC15F2K32S2-28I-SOP28  [SOP-28_L17.9-W7.5-P1.27-LS10.3-BL]  38.71 21.72 90 top
U11  LM324DT  [SOIC-14_L8.7-W3.9-P1.27-LS6.0-BL]  60.88 40.69 90 top
X1  11.0592MHz  [HC-49US_L11.5-W4.5-P4.88]  57.2 23.98 90 top

## Footprints (pads in the part's own frame, mm; a bottom-side part is the same pattern mirrored in y, then rotated)
C0805
  rect 1.41x1.35 smd: 1(-1,0) 2(1,0)
C1206
  rect 1.485x1.728 smd: 1(-1.593,0) 2(1.593,0)
CAP-SMD_BD6.3-L6.6-W6.6-LS7.6-RD
  rect 3.5x1.2 smd: 1(-2.67,0) 2(2.67,0)
CAP-SMD_BD10.0-L10.3-W10.3-LS11.3-FD
  rect 4.5x1.65 smd: 1(-4.5,0) 2(4.5,0)
CONN-TH_2P-P5.08_DB128L-5.08-2P
  round 2.4 hole 1.6: 1(-2.54,0) 2(2.54,0)
CONN-TH_4P_DB128L-5.08-4P-GN-S
  rect 2.4x2.4 hole 1.575x1.5: 1(7.62,0)
  round 2.4 hole 1.575x1.5: 2(2.54,0) 3(-2.54,0) 4(-7.62,0)
CONN-TH_DB128L-5.08-3P
  round 2.4 hole 1.6: 1(-5.08,0) 2(0,0) 3(5.08,0)
F1812
  rect 1.407x3.499 smd: 1(-1.853,0) 2(1.853,0)
FPC-SMD_P1.00-8P_LCS-XJ-H2.5
  rect 0.6x2.2 smd: 1(-3.499,-0.943) 2(-2.499,-0.943) 3(-1.5,-0.943) 4(-0.499,-0.943) 5(0.5,-0.943) 6(1.5,-0.943) 7(2.5,-0.943) 8(3.5,-0.943)
  rect 2.6x3 smd: 9(5.85,0.943) 10(-5.85,0.943)
HC-49US_L11.5-W4.5-P4.88
  rect 1.5x1.5 hole 0.9: 1(-2.44,0)
  round 1.5 hole 0.9: 2(2.44,0)
HDR-TH_4P-P2.54-V-F
  rect 1.7x1.7 hole 1.1: 1(-3.81,0)
  round 1.7 hole 1.1: 2(-1.27,0) 3(1.27,0) 4(3.81,0)
IND-SMD_L12.0-W12.0_YPRH120X
  rect 3x5.5 smd: 1(-5,0) 2(5,0)
LED_TH-3mm
  round 1.524 hole 0.914: 1(-1.27,0) 2(1.27,0)
M2螺丝
  round 2 hole 2: 1(0,0)
R0805
  rect 1.133x1.377 smd: 1(-1,0) 2(1,0)
RELAY-TH_G5V-1
  round 2.1 hole 1.2: 1(-5.08,-2.54) 2(-2.54,-2.54) 5(5.08,-2.54) 6(5.08,2.54) 9(-2.54,2.54) 10(-5.08,2.54)
RES-ADJ-TH_3P-L10.0-W10.0-P2.50-BL-BS
  round 1.524 hole 0.762: 1(0,2.5) 2(0,0) 3(0,-2.5)
SMA_L4.3-W2.5-LS5.0-RD
  rect 2x1.593 smd: 1(-2.1,0) 2(2.1,0)
SOIC-14_L8.7-W3.9-P1.27-LS6.0-BL
  oval 0.574x2.038 smd: 1(-3.81,-2.769) 2(-2.54,-2.769) 3(-1.27,-2.769) 4(0,-2.769) 5(1.27,-2.769) 6(2.54,-2.769) 7(3.81,-2.769) 8(3.81,2.769) 9(2.54,2.769) 10(1.27,2.769) 11(0,2.769) 12(-1.27,2.769) 13(-2.54,2.769) 14(-3.81,2.769)
SOP-4_L6.5-W4.6-P2.54-LS9.6-TL
  rect 2.5x1.8 smd: 1(-4.9,1.27) 2(-4.9,-1.27) 3(4.9,-1.27) 4(4.9,1.27)
SOP-8_L4.9-W3.9-P1.27-LS6.0-BL
  oval 0.63x1.865 smd: 1(-1.905,-2.683) 2(-0.635,-2.683) 3(0.635,-2.683) 4(1.905,-2.683) 5(1.905,2.683) 6(0.635,2.683) 7(-0.635,2.683) 8(-1.905,2.683)
SOP-8_L5.0-W4.0-P1.27-LS6.0-BL
  oval 0.574x2.035 smd: 1(-1.905,-2.768) 2(-0.635,-2.768) 3(0.635,-2.768) 4(1.905,-2.768) 5(1.905,2.768) 6(0.635,2.768) 7(-0.635,2.768) 8(-1.905,2.768)
SOP-28_L17.9-W7.5-P1.27-LS10.3-BL
  oval 0.63x1.615 smd: 1(-8.255,-4.957) 2(-6.985,-4.957) 3(-5.715,-4.957) 4(-4.445,-4.957) 5(-3.175,-4.957) 6(-1.905,-4.957) 7(-0.635,-4.957) 8(0.635,-4.957) 9(1.905,-4.957) 10(3.175,-4.957) 11(4.445,-4.957) 12(5.715,-4.957) 13(6.985,-4.957) 14(8.255,-4.957) 15(8.255,4.957) 16(6.985,4.957) 17(5.715,4.957) 18(4.445,4.957) 19(3.175,4.957) 20(1.905,4.957) 21(0.635,4.957) 22(-0.635,4.957) 23(-1.905,4.957) 24(-3.175,4.957) 25(-4.445,4.957) 26(-5.715,4.957) 27(-6.985,4.957) 28(-8.255,4.957)
SOT-23-3_L2.9-W1.3-P1.90-LS2.4-BR
  rect 1.25x0.7 smd: 1(1,-0.95) 2(1,0.95) 3(-1,0)
SOT-23-6_L2.9-W1.6-P0.95-LS2.8-BR
  rect 1.1x0.6 smd: 1(1.35,-0.95) 2(1.35,0) 3(1.35,0.95) 4(-1.35,0.95) 5(-1.35,0) 6(-1.35,-0.95)
SW-TH_SK12D07VG4
  round 1.524 hole 0.914: 1(-2,0) 2(0,0) 3(2,0)
  oval 1.4x2.2 hole 0.8x1.6: 4(4.15,0) 5(-4.15,0)
TH_PCON
  round 1.5 hole 1: 1(0,0) 2(2.54,0) 3(5.08,0) 4(7.62,0)
TO-263-5_L10.2-W8.9-P1.70-LS15.2-BR
  rect 3.6x1 smd: 1(5.25,-3.4) 2(5.25,-1.7) 3(5.25,0) 4(5.25,1.7) 5(5.25,3.4)
  rect 9.2x10.668 smd: 6(-5.25,0)

## Nets
As in the schematic.

Pads without a net: SW1 3 4 5; U10 8 11 13 17 18 19 20

## Via types
v1: diameter 0.635, hole 0.381, Top Layer to Bottom Layer, 148 vias

## Routing (per net, layer and track width the routed paths; a pad name or vN(x,y) marks a point on that pad's centre or on a via; arc(x,y) is an arc through that point)
GND: length 126
  Top Layer w0.61: R19.2 v1(74.45,10.24) ; U6.5 v1(68.22,0.91) 68.25,0.89 ; v1(45.41,29.67) 45.11,29.97 U10.14 ; v1(29.36,31.22) v1(30.48,31.22) ; v1(29.36,31.22) 29.36,33.6 ; v1(29.36,31.22) v1(28.17,31.22) ; C5.2 10.31,25.81 v1(8.74,25.81) ; U1.5 v1(27.74,48.7) ; v1(48.79,47.73) 50.42,47.73 R13.1 ; v1(53.52,18.47) v1(52.39,18.47) 51.26,18.47 v1(51.23,18.44) v1(51.23,19.68) v1(51.23,20.92) v1(51.23,22.16) v1(51.23,23.4) v1(49.81,23.4) v1(48.39,23.4) v1(46.96,23.4) v1(45.54,23.4) ; v1(53.52,18.47) 53.52,20.43 C22.2 ; v1(53.52,18.47) v1(54.66,18.47) v1(55.8,18.47) v1(56.94,18.47) v1(58.07,18.47) v1(59.21,18.47) v1(60.35,18.47) v1(60.35,19.85) v1(60.35,21.28) v1(60.35,22.7) v1(60.35,24.12) v1(60.35,25.55) v1(60.35,26.97) v1(60.35,28.4) v1(60.35,29.82) v1(59.2,29.82) v1(57.49,29.82) v1(55.78,29.82) v1(54.06,29.82) ; v1(13.97,4.12) 13.94,4.14 13.94,6.33 ; C8.1 22.48,20.76 v1(22.48,20.75) ; C11.1 17.8,25.73 v1(15.95,25.73) ; v1(42.6,45.92) 41.44,47.07 U1.6 ; C3.1 v1(24.18,35.15) ; C2.1 20.57,35.23 v1(20.55,35.2) ; 65.66,33.66 v1(65.63,33.68) C15.2 ; CN5.10 v1(23.8,4.44) ; v1(7.21,4.47) 7.24,4.44 CN5.9 ; U1.3 v1(27.84,52.1) ; v1(54.06,29.82) v1(52.35,29.82) v1(51.44,29.82) 51.42,29.81 v1(51.42,25.15) v1(50.23,25.15) v1(49.04,25.15) v1(47.85,25.15) v1(46.66,25.15) v1(45.47,25.15) ; v1(54.06,29.82) 53.29,29.05 C19.2 ; v1(49.12,28.7) 49.12,27.47 C20.1 ; D1.2 v1(20.65,46.53) ; v1(13.18,47.88) v1(13.18,47.07) ; v1(13.18,47.88) v1(13.18,48.67) ; v1(13.18,47.88) 16.31,47.88 C1.2 ; v1(19.71,25.17) 20.46,25.17 C12.1 ; v1(54.36,33.76) 52.74,33.76 C23.1 ; C6.2 14.17,25.65 v1(12.24,25.65) ; R1.1 v1(8.84,56.59) ; D4.3 v1(61.69,8.54) 61.39,8.84 61.39,10.83 C21.2 ; R29.1 R28.1 51.06,10.02 v1(52.3,8.79) ; R7.2 v1(50.46,38.64) ; v1(11.2,32.33) 12.68,32.33 D2.2 ; v1(48.64,44.12) 50.56,44.12 C13.1
  vias: v1(4.8,16.13) v1(5.71,16.13) v1(10.13,13.36) v1(10.13,12.5) v1(11.05,13.36) v1(11.07,12.5) v1(14.64,13.33) v1(14.64,12.47) v1(15.56,13.33) v1(15.58,12.47) v1(17.82,15.11) v1(17.82,14.25) v1(18.73,15.11) v1(18.76,14.25) v1(27.69,17.96) v1(27.74,16.64) v1(28.6,17.96) v1(28.65,16.64) v1(35.33,25.86) v1(35.33,24.94) v1(51.44,28.6) v1(51.44,27.38) v1(51.44,26.16) v1(59.84,41.22) v1(59.84,40.31) v1(68.07,11.07) v1(68.25,4.83) v1(68.99,11.07) v1(69.16,4.83) v1(69.69,41.07) v1(69.69,40.21) v1(70.6,41.07) v1(70.62,40.21) v1(80.9,39.32) v1(80.9,38.41)
VBAT: length 132.8
  Top Layer w0.61: 47.32,43.61 47.32,40.84 47.42,40.74 50.44,40.74 R6.2 ; 47.32,43.61 47.02,43.92 35.97,43.92 35.53,44.35 35.53,54.81 34.85,55.5 U1.1 30.92,55.47 28.91,55.47 28.22,56.16 28.22,58.14 27.51,58.85 8.18,58.85 7.36,58.03 C1.1 ; 47.32,43.61 47.32,53.16 48.06,53.9 61.09,53.9 61.52,54.33 61.52,58.52 62.13,59.13 90.78,59.13 92,57.91 92,54.94 CN4.4
VCC: length 314.8
  Top Layer w0.381: U3.2 26.51,24.08 27.23,24.08 27.46,24.31 27.46,26.97 27.82,27.34 v1(29.09,27.34) R3.1
  Top Layer w0.61: C20.2 47.08,31.64 49.22,33.78 50.61,33.78 C23.2 ; C20.2 47.23,27.43 ; C20.2 U10.12 ; 12.73,1.83 5.77,1.83 5.33,2.26 5.33,5.38 5.18,5.54 4.06,5.54 ; 12.73,1.83 12.95,2.06 12.95,6.32 CN5.7 ; 12.73,1.83 v1(27.58,1.83) ; U6.8 72.03,1.4 72.52,0.91 74.19,0.91 74.32,1.04 74.32,2.45 R21.2 77.42,2.48 R18.2 80.08,2.43 80.16,2.51 80.09,2.59 80.09,5.74 79.53,6.3 78.08,6.3 77.47,6.91 77.47,15.65 76.78,16.33 U8.1 ; LED1.1 17.84,56.59 22.76,56.59 23.57,55.78 23.57,43.84 22.38,42.65 ; U2.2 1.27,22.33 1.04,22.1 1.04,14 1.52,13.51 3.85,13.51 ; H1.3 51.89,58.32 51.89,56.13 51.41,55.65 47.55,55.65 47.27,55.93 47.27,58.27 46.89,58.65 32.21,58.65 31.9,58.34 v1(31.9,57.18) ; v1(70.94,19.71) 70.94,17.07 U8.1 ; 3.85,13.51 C18.1 3.85,9.27 3.27,8.69 2.26,8.69 1.88,8.31 1.88,5.79 2.13,5.54 4.06,5.54 ; 3.85,13.51 R23.1 ; U11.4 62.43,40.69 61.77,40.03 61.77,31.67 61.29,31.19 ; 61.29,31.19 51.18,31.19 50.93,31.44 50.93,33.98 ; 61.29,31.19 67.64,31.19 68.07,30.76 68.07,29.95 68.45,29.57 69.8,29.57 U4.1 70.06,29.57 71.73,29.57 72.39,28.91 72.39,26.34 71.5,25.45 v1(71.17,25.45) ; U8.1 68.53,16.33 67.92,15.72 v1(67.92,14.81) ; 4.06,5.54 U7.2 ; R17.1 32.12,8.66 v1(30.66,8.66) 27.58,8.66 ; v1(25.93,57.15) 25.98,57.1 25.98,50.83 26.41,50.4 U1.4 30.97,50.37 33.05,50.37 33.66,49.76 33.66,40.36 L1.1 ; v1(65.41,14.76) 65.48,14.68 65.48,10.59 65.1,10.21 63.58,10.21 63.14,10.64 63.14,12.06 62.92,12.29 59.66,12.29 59.38,12 C21.1 59.26,10.73 U9.1 59.26,2.93 ; U5.2 26.63,8.66 27.58,8.66 ; v1(27.58,7.77) 27.58,8.66 ; U3.2 23.11,23.98 21.77,22.63 ; 31.85,36.86 31.85,27.95 R3.1
  Bottom Layer w0.61: v1(67.92,14.81) 67.87,14.76 v1(65.41,14.76) ; v1(71.17,25.45) 71.17,19.94 v1(70.94,19.71) ; v1(47.45,31.98) 47.22,32.21 35.15,32.21 33.07,30.12 29.62,30.12 29.09,29.6 v1(29.09,27.34) ; v1(25.93,57.15) 31.88,57.15 v1(31.9,57.18) ; v1(27.58,1.83) v1(27.58,7.77)
VEE: length 55.3
  Top Layer w0.61: v1(42.95,33.07) 44.91,33.07 48.56,36.73 v1(48.56,38.96) ; v1(48.56,41.96) 48.56,42.06 48.97,42.47 52.38,42.47 52.66,42.76 C13.2 52.87,44.02 53.44,44.02 53.59,43.87 53.59,43.05 55.96,40.69 U11.11 ; U3.1 24.19,24.93 23.83,25.29 23.83,33.02 v1(23.85,33.05)
  Bottom Layer w0.61: v1(42.95,33.07) 42.93,33.05 v1(23.85,33.05) ; v1(48.56,38.96) v1(48.56,41.96)
0: length 104.4
  Top Layer w0.254: R27.2 71.85,20.97 Q2.2
  Top Layer w0.305: R16.2 79.21,36.09 80.85,36.09 80.97,35.97 v1(80.97,34.59) ; v1(81.05,32.39) 81.81,31.62 81.81,28.7 80.26,27.15 U4.3 79.73,25.78 79.42,25.48 76.28,25.48 v1(76.2,25.55)
  Top Layer w0.381: v1(23.52,19.13) 23.51,19.12 R2.1 ; Q2.2 v1(71.97,19.67) 71.97,18.22 73.16,17.03 77.07,17.03 78.33,15.77 78.33,14 78.71,13.61 79.83,13.61 U8.3 ; R27.2 69.57,20.95 69.57,19.36 69.27,19.05 68.88,19.05 68.48,18.64 68.48,17.45 67.91,16.88 47.57,16.88 45.52,18.93 v1(45.52,22.12)
  Bottom Layer w0.254: v1(71.97,19.67) 71.97,20.62 72.33,20.97 75.96,20.97 76.23,21.23 76.23,25.53 v1(76.2,25.55)
  Bottom Layer w0.305: v1(80.97,34.59) 80.97,32.46 v1(81.05,32.39)
  Bottom Layer w0.381: v1(45.52,22.12) 26.52,22.12 v1(23.52,19.13)
485_RXD: length 42.9
  Top Layer w0.254: R18.1 75.14,6.76 72.24,6.76 72.03,6.96 U6.1 71.96,8.05 71.96,9.07 71.7,9.32 71.7,11.71 71.32,12.09 v1(68.3,12.09) ; U10.3 46.41,16 46.96,15.44 64.06,15.44 64.29,15.21 64.29,12.32 v1(64.59,12.01)
  Bottom Layer w0.254: v1(64.59,12.01) 68.22,12.01 v1(68.3,12.09)
485_TXD: length 40.4
  Top Layer w0.254: R21.1 72.6,6.22 68.4,6.22 68.22,6.4 U6.4 68.25,8 68.25,8.98 66.5,10.73 66.5,15.65 66.24,15.9 47.17,15.9 45.8,17.27 U10.4
ADC0: length 59.3
  Top Layer w0.254: v1(58.24,45.57) 58.24,44.5 U11.8 56.31,44.5 55.45,45.36 55.45,50.57 54.84,51.18 52.49,51.18 R5.1 ; U10.6 41.25,19.81 40.84,20.22 40.84,29.77 42.58,31.51 45.06,31.51 49.19,35.64 54.89,35.64 55.7,36.45 55.7,38.35 56.13,38.79 59.69,38.79 61.19,40.28 v1(61.19,45.59)
  Bottom Layer w0.254: v1(61.19,45.59) 58.27,45.59 v1(58.24,45.57)
ADC1: length 34.7
  Top Layer w0.254: U10.7 42.32,21.08 41.55,21.84 41.55,29.69 42.91,31.05 45.25,31.05 49.38,35.18 55.98,35.18 56.51,35.71 56.51,36.55 56.79,36.83 58.06,36.83 U11.14 58.14,36.91 59.69,36.91 59.77,36.98 59.77,38 59.61,38.15 U11.13
HEAT1: length 6.8
  Top Layer w0.305: 18.94,6.33 18.94,7.18 19.48,7.72 24.62,7.72 U5.3
HEAT2: length 9.6
  Top Layer w0.305: U7.3 7.06,6.5 7.37,6.81 7.37,8.2 7.67,8.51 11.66,8.51 11.99,8.18 11.99,6.37 CN5.8
KC1: length 16.2
  Top Layer w0.381: CN2.1 93.78,26.92 83.11,37.59
KC2: length 15
  Top Layer w0.381: CN3.1 91.26,8.92 RELAY2.1
KO1: length 6.9
  Bottom Layer w0.381: 88.19,37.59 94.39,37.59 CN2.3
KO2: length 7.5
  Top Layer w0.381: CN3.3 92.76,16.94 RELAY2.10
KX1: length 13.7
  Bottom Layer w0.254: 88.19,27.43 90.33,27.43 CN2.2
  Bottom Layer w0.381: 83.11,27.43 88.19,27.43
KX2: length 15
  Bottom Layer w0.381: CN3.2 94.9,13.37 RELAY2.6 RELAY2.5
P12: length 38.3
  Top Layer w0.254: 70.76,9.3 70.76,10.18 R19.1 70.63,10.31 67.56,10.31 66.98,10.9 66.98,16.1 66.73,16.36 47.36,16.36 45.17,18.54 U10.5 ; 70.76,9.3 U6.2 ; 70.76,9.3 69.73,9.3 69.57,9.14 69.57,8.05 U6.3
P20: length 39.5
  Top Layer w0.305: U10.23 31.93,19.81 31.47,19.36 26.2,19.36 17.26,10.41 5.88,10.41
  Top Layer w0.457: U7.1 4.09,7.47 5.56,7.47 5.68,7.58 5.68,10.21 C18.2 5.88,10.41 R23.2
P21: length 24.5
  Top Layer w0.254: 14.94,6.33 14.94,7.31 26.28,18.64 33.65,18.64 U10.24
P22: length 23.1
  Top Layer w0.254: 15.94,6.33 15.94,7.55 25.69,17.3 33.73,17.3 U10.25
P23: length 21.7
  Top Layer w0.254: U10.26 33.7,15.95 24.99,15.95 16.94,7.9 16.94,6.33
P24: length 20.4
  Top Layer w0.254: 17.94,6.33 17.94,8.25 24.42,14.73 U10.27
P25: length 17.6
  Top Layer w0.254: R17.2 35.5,6.8 35.76,7.06 35.76,13.28 35.64,13.41 33.8,13.41 U10.28
  Top Layer w0.61: R17.2 32.23,6.77 U5.1
P36: length 44.2
  Top Layer w0.254: U10.21 32.03,22.35 31.27,21.59 v1(31.27,20.47) ; v1(48.82,14.76) 59.36,14.76 59.49,14.63 59.49,13.95 R26.1
  Bottom Layer w0.254: v1(48.82,14.76) 44.81,10.74 31.65,10.74 31.27,11.12 v1(31.27,20.47)
P37: length 42.4
  Top Layer w0.254: R15.1 64.96,30.16 64.62,30.51 v1(48.06,30.51) ; U10.22 36.07,21.08 36.3,21.31 36.3,27.46 36.83,27.99 39.83,27.99 v1(39.85,28.02)
  Bottom Layer w0.254: v1(39.85,28.02) 42.32,28.02 42.6,28.3 42.6,29.24 43.87,30.51 v1(48.06,30.51)
SCL: length 21.9
  Top Layer w0.254: 56.87,2.52 56.87,2.95 56.84,2.97 56.84,5.41 56.39,5.87 53.34,5.87 50.09,9.12 50.09,12.45 49.94,12.6 R29.2 46.93,14.73 U10.2
SDA: length 18.3
  Top Layer w0.254: U10.1 45.69,13.46 R28.2 49.06,9.36 53.14,5.28 55.25,5.28 55.6,4.93 55.6,2.52
SN+: length 31.3
  Top Layer w0.457: U11.3 74.52,39.42 77.62,42.52 77.62,52.25 78.18,52.81 81.46,52.81 81.86,53.21 81.86,54.76 CN4.2
SN-: length 25.5
  Top Layer w0.457: CN4.1 76.86,42.88 75.95,41.96 U11.5
VRM: length 149
  Top Layer w0.61: 83.11,35.05 82.96,34.9 82.96,33.71 82.77,33.52 R14.1 79.12,31.95 v1(78.56,31.39) ; U2.4 13.89,17.25 C10.2 R2.2 22.88,17.12 v1(23.44,17.68) ; C9.2 10.49,16.99 10.47,17.02 ; v1(75.54,31.39) 75.54,27.31 74.45,26.21 74.45,24.49 74.34,24.38 ; 74.34,24.38 78.58,24.38 D5.1 80.84,24.07 81.25,24.49 89.56,24.49 89.81,24.23 89.81,21.41 89.51,21.11 87.74,21.11 R24.2 87.64,21.01 86.46,21.01 86.21,20.75 v1(86.21,19.76) ; 74.34,24.38 65.07,24.38 64.39,23.7 64.39,21.51 64.93,20.97 R25.1 66.6,20.92 66.6,17.83 66.34,17.58 47.86,17.58 46.38,19.06 v1(46.38,21.26) ; v1(86.03,38.41) 86.03,40.84 86.06,40.87 87.42,40.87 D3.1 87.76,41.21 R9.2
  Bottom Layer w0.61: v1(86.21,19.76) 86.21,17.37 RELAY2.2 ; v1(23.44,17.68) 27.19,21.42 33.38,21.42 33.54,21.26 v1(46.38,21.26) ; v1(78.56,31.39) v1(75.54,31.39) ; v1(86.03,38.41) 86.03,37.97 83.11,35.05
XTAL1: length 15.3
  Top Layer w0.254: X1.2 56.61,25.82 C19.1 53.29,24.55 53.2,24.46 45.03,24.46 44.6,24.89 U10.10
XTAL2: length 15.5
  Top Layer w0.254: U10.9 44.6,23.62 45.03,24.05 53.2,24.05 53.29,23.96 C22.1 56.07,22.67 X1.1
$1N5406: length 8.2
  Top Layer w0.61: CN1.1 13.26,37.54
$1N6010: length 27.6
  Top Layer w0.61: L1.2 45.19,38.83 45.19,42.32 44.4,43.1 35.08,43.1 34.47,43.71 34.47,52.48 33.15,53.8 U1.2
$1N7874: length 3.4
  Top Layer w0.305: U3.5 31.12,23.98 31.24,24.1 R3.2
$1N8048: length 6.4
  Top Layer w0.305: C7.2 29.61,20.88 28.32,20.88 28.07,21.13 28.07,24.77 28.23,24.93 U3.6
$1N8053: length 3.8
  Top Layer w0.305: 26.45,20.9 26.35,21.01 25.63,21.01 25.5,21.13 25.5,22.91 25.62,23.03 U3.3
$1N8284: length 2.6
  Top Layer w0.254: LED1.2 15.29,56.59 R1.2
$1N8627: length 31.6
  Top Layer w0.61: v1(11.3,49.99) 11.3,41.33 11.91,40.72 16.38,40.72 16.89,40.21 16.89,37.62 F1.2 17.01,37.5 D2.1
  Bottom Layer w0.61: v1(11.3,49.99) 11.29,50 SW1.1
$2N2031: length 18.2
  Top Layer w0.457: C16.1 72.6,45.4 R11.1 69.66,45.42 69.44,45.42 ; R12.2 64.22,48.84 69.39,48.84 69.44,48.8 69.44,45.42 ; 69.44,45.42 68.86,45.42 67.94,44.5 U11.7
$2N2092: length 20.8
  Top Layer w0.254: R12.1 60.76,48.89 60.48,48.62 60.48,42.29 60.15,41.96 U11.10 56.03,41.96 54.38,43.61 54.38,47.32 54.03,47.68 52.47,47.68 R13.2
$2N2099: length 26.9
  Top Layer w0.254: R4.1 61.97,52.3 60.5,52.3 59.74,51.54 59.74,43.69 59.28,43.23 U11.9 55.73,43.23 54.99,43.97 54.99,48.41 54.48,48.92 51.33,48.92 50.52,49.73 50.52,51.1 R5.2
$2N2266: length 31.9
  Top Layer w0.381: U11.2 v1(66.78,38.15) 67.37,38.15 C14.1 72.11,35.77 R8.1
  Bottom Layer w0.254: R10.1 70.74,56.75 70.74,52.15 70.46,51.87 67.03,51.87 66.78,51.62 v1(66.78,38.15)
$2N2273: length 26.2
  Top Layer w0.254: R4.2 65.51,52.02 v1(65.53,51.99)
  Top Layer w0.381: R8.2 72.11,33.77 C14.2 69.35,33.77 66.24,36.88 v1(65.54,36.88) U11.1
  Bottom Layer w0.254: v1(65.53,51.99) 65.54,51.98 v1(65.54,36.88)
$2N2314: length 29.8
  Top Layer w0.457: U11.6 72.43,43.23 C16.2 ; 72.82,43.71 74.24,43.71 74.62,44.09 74.62,53.24 74.12,53.75 68.71,53.75 68.25,54.2 68.25,56.74 68.12,56.87
$2N3023: length 28.9
  Top Layer w0.254: CN6.1 43.22,0.8 64.87,0.8 65.13,1.05 65.13,1.59 R20.1
$2N3053: length 20.6
  Top Layer w0.254: R22.1 62.18,1.44 46.9,1.44 43.92,4.42 CN6.2
$2N3244: length 13
  Top Layer w0.254: D4.1 62.7,3.96 R22.2 63.43,2.69 66.95,2.69 67.26,3 67.26,3.86 67.44,4.04 69.27,4.04 69.47,3.84 69.47,2.46 U6.6
$2N3251: length 12.5
  Top Layer w0.254: 64.6,5.98 64.85,5.74 70.54,5.74 70.76,5.51 U6.7 ; 64.6,5.98 D4.2 ; 64.6,5.98 64.6,4.11 R20.2
$2N3377: length 3
  Top Layer w0.381: U4.2 69.9,27.18 R15.2
$2N3466: length 6.4
  Top Layer w0.61: U4.4 79.68,29.64 77.37,29.64 77.12,29.89 R14.2
$2N4164: length 8.9
  Top Layer w0.254: v1(68.05,13.77) 68.07,13.79 U8.2 ; v1(63.47,13.77) 61.5,13.77 R26.2
  Bottom Layer w0.254: v1(68.05,13.77) v1(63.47,13.77)
$2N4168: length 12.6
  Top Layer w0.305: U8.4 78.76,17.58 74.4,17.58 72.96,19.01 72.96,21.61 72.95,21.63 72.95,22.02 Q2.1
$2N4738: length 4.4
  Top Layer w0.254: R9.1 87.72,47.02 LED2.1
$2N4742: length 17.7
  Top Layer w0.381: D3.2 83.41,41.06 LED2.2 ; D3.2 82.63,41.81 78.36,41.81 78.12,41.56 Q1.3 ; D3.2 84.38,40.06 84.38,38.86 88.19,35.05
$2N4893: length 4
  Top Layer w0.381: LED3.1 87.59,23.14 R24.1
$2N4914: length 20.1
  Top Layer w0.381: Q2.3 78.44,22.05 78.94,21.54 78.94,19.92 D5.2 82.96,19.87 LED3.2 83.69,19.02 RELAY2.9
$2N5025: length 10
  Top Layer w0.254: 53.7,39.53 53.81,39.42 U11.12 ; 53.7,39.53 53.7,40.46 53.39,40.77 R6.1 ; 53.7,39.53 53.7,37.64 53.42,37.36 52.53,37.36 R7.1
$2N7138: length 51.6
  Top Layer w0.254: U10.16 39.95,28.7 40.21,28.96 v1(40.21,40.87)
  Bottom Layer w0.254: v1(40.21,40.87) 40.21,54.31 41.25,55.35 55.45,55.35 56.39,56.29 56.39,58.93
$2N7141: length 48
  Top Layer w0.254: U10.15 38.86,29.97 39.14,30.25 39.14,41.07 v1(39.19,41.12)
  Bottom Layer w0.254: 54.05,59.13 54.05,56.97 52.88,55.8 40.21,55.8 39.19,54.79 v1(39.19,41.12)

## Copper pours and planes (outline as drawn; the poured copper is in the pictures)
GND on Top Layer: -10.54,66.83 117.63,66.83 117.63,-11.38 -10.54,-11.38
GND on Bottom Layer: -12.39,69.62 119.96,69.62 119.96,-4.85 -12.39,-4.85
VBAT on Top Layer: 1.14,49 10.06,49 10.06,46.96 1.14,46.96
VCC on Top Layer: 19.38,45.59 37.13,45.59 37.13,34.67 19.38,34.67
VCC on Top Layer: 1.6,23.52 22.15,23.52 22.15,21.27 1.6,21.27
0 on Top Layer: 78.27,39.69 80.09,39.69 80.09,35.02 78.27,35.02
0 on Top Layer: 1.75,20.73 19,20.73 19,18.29 1.75,18.29
$2N2314 on Top Layer: 64.08,58.37 68.81,58.37 68.81,55.3 64.08,55.3
$2N3466 on Top Layer: 75.82,39.98 77.93,39.98 77.93,32.11 75.82,32.11
$2N4168 on Top Layer: 65.53,23.7 72.96,23.7 72.96,22.1 65.53,22.1

Small or netless copper shapes (teardrops, artwork), in the pictures only: 287 on Top Layer, 32 on Bottom Layer
